# EAGLE schematic testtool (EAGLE 9.5.2)

## Sheet 1 of 7
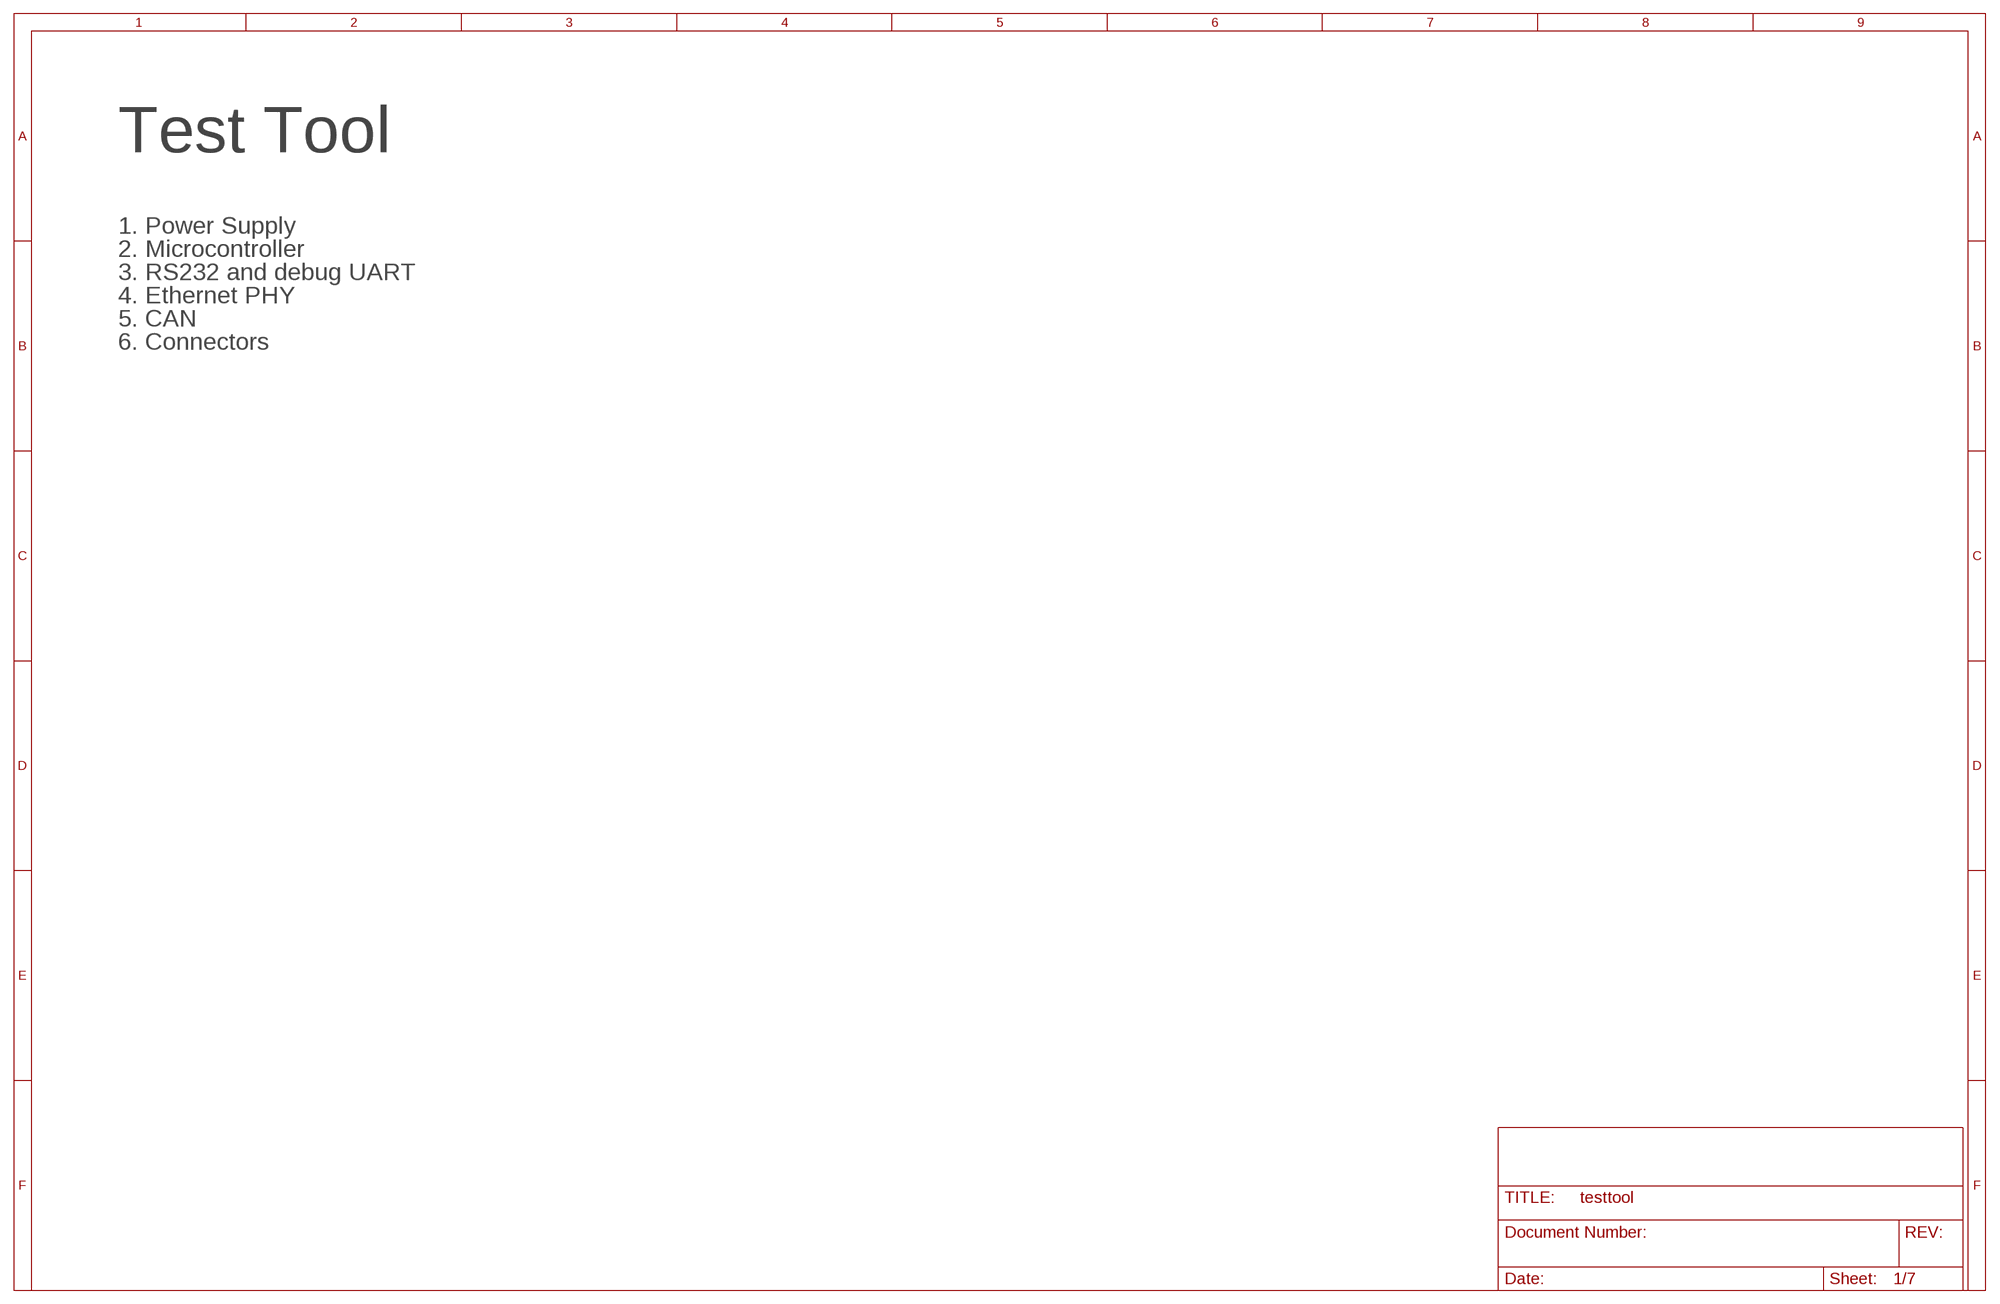
[diagram p0: schematic, sheet 1]

### Notes on the sheet
- Test Tool
- 1. Power Supply
- 2. Microcontroller
- 3. RS232 and debug UART
- 4. Ethernet PHY
- 5. CAN
- 6. Connectors

## Sheet 2 of 7
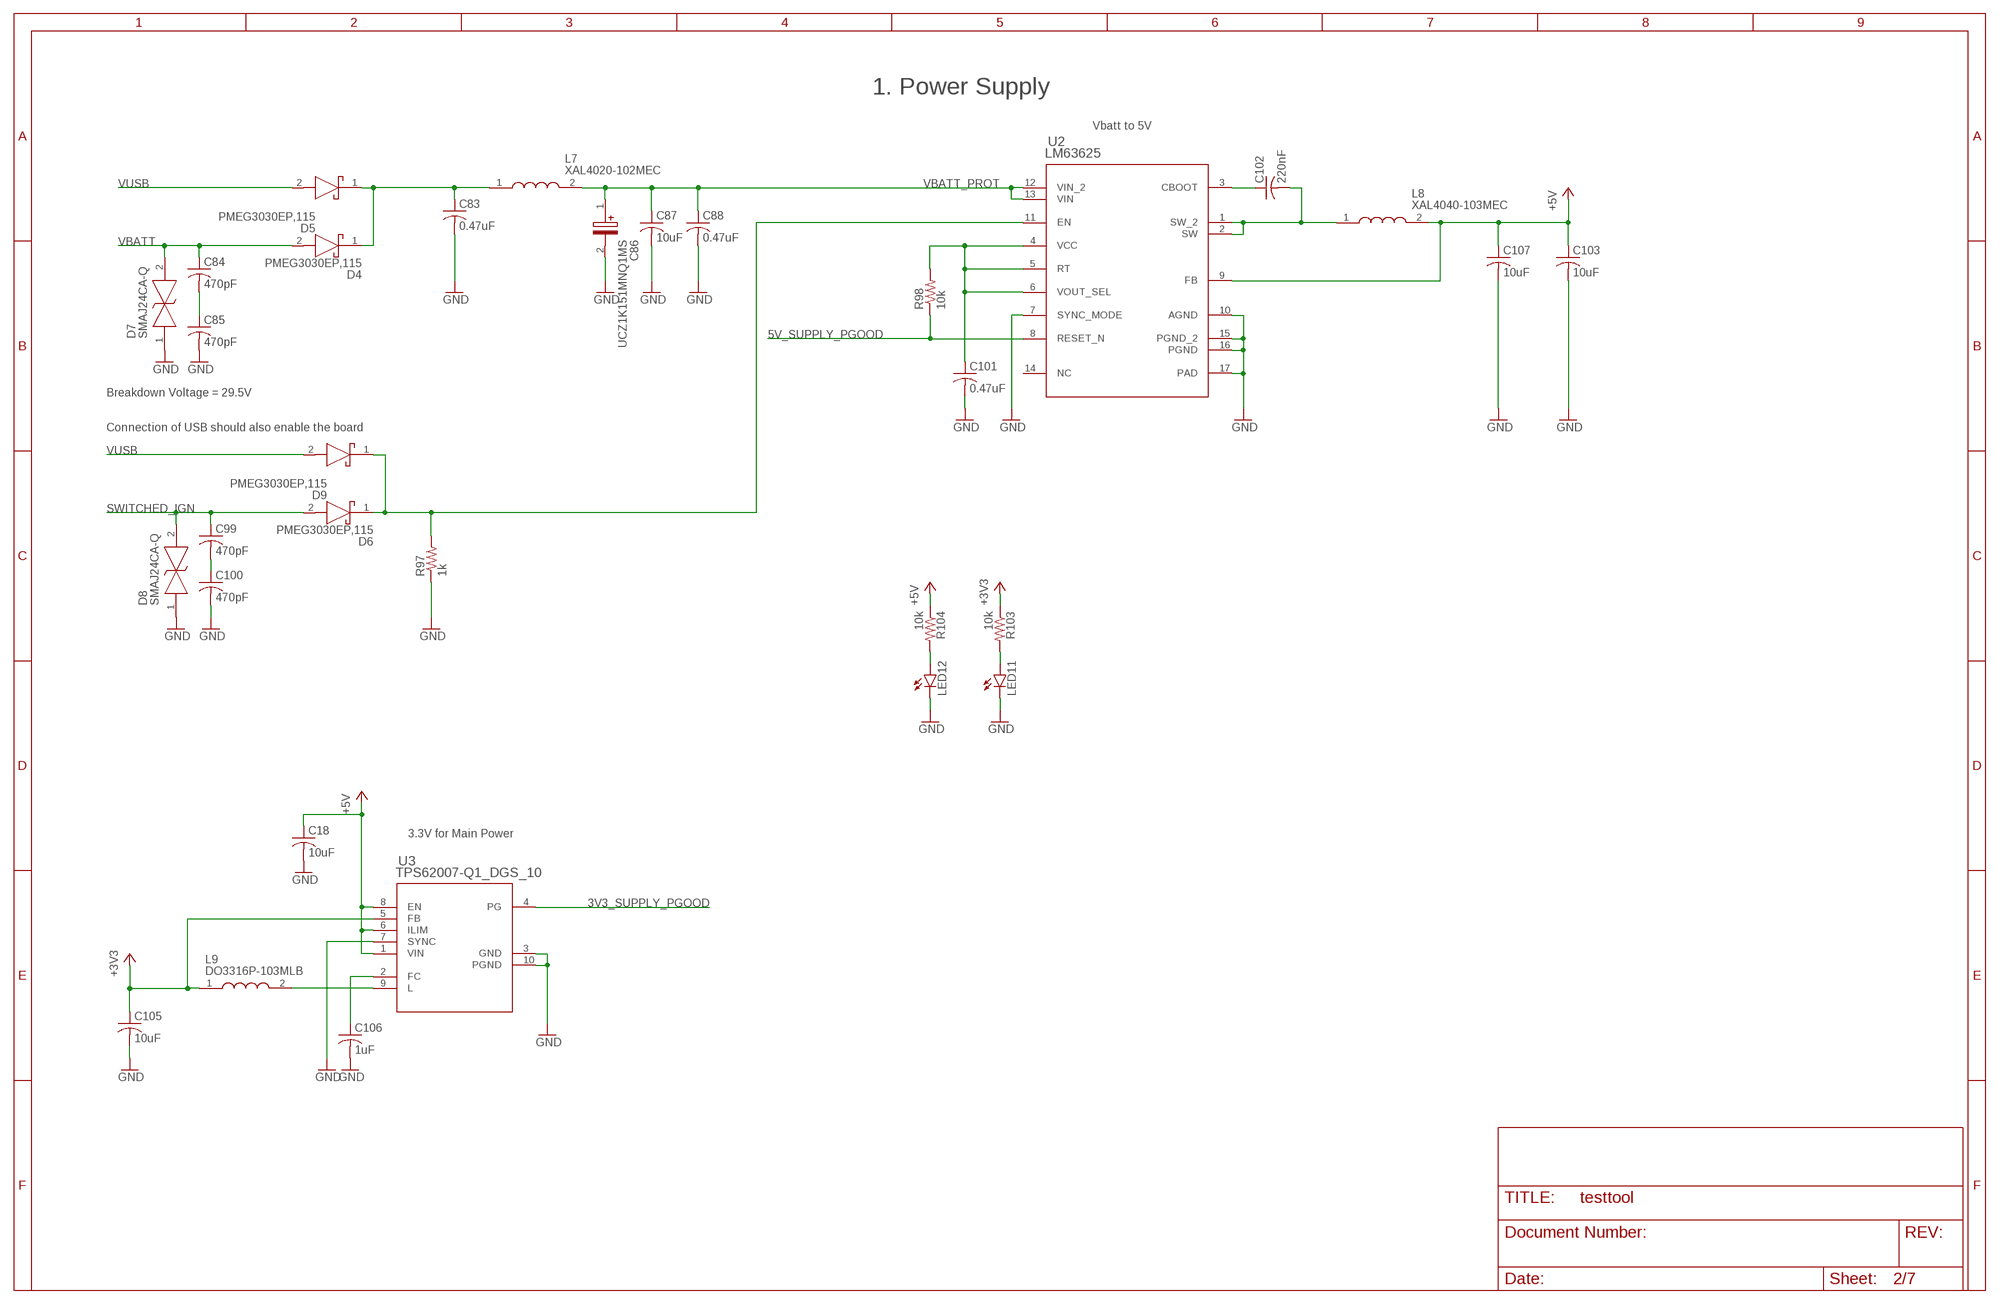
[diagram p1: schematic, sheet 2]

### Parts
C18  10uF  C-USC0805  [C0805]
C83  0.47uF  C-USC0805  [C0805]
C84  470pF  C-USC0805  [C0805]
C85  470pF  C-USC0805  [C0805]
C86  UCZ1K151MNQ1MS  [CAPAE1360X1450N]
C87  10uF  C-USC0805  [C0805]
C88  0.47uF  C-USC0805  [C0805]
C99  470pF  C-USC0805  [C0805]
C100  470pF  C-USC0805  [C0805]
C101  0.47uF  C-USC0603  [C0603]
C102  220nF  C-USC0805  [C0805]
C103  10uF  C-USC0805  [C0805]
C105  10uF  C-USC0805  [C0805]
C106  1uF  C-USC0603  [C0603]
C107  10uF  C-USC0805  [C0805]
D4  PMEG3030EP,115  [SODFL4725X110N]
D5  PMEG3030EP,115  [SODFL4725X110N]
D6  PMEG3030EP,115  [SODFL4725X110N]
D7  SMAJ24CA-Q  [DIONM5127X229N]
D8  SMAJ24CA-Q  [DIONM5127X229N]
D9  PMEG3030EP,115  [SODFL4725X110N]
L7  XAL4020-102MEC  [XAL40XX]
L8  XAL4040-103MEC  [XAL40XX]
L9  DO3316P-103MLB  [DO3316P103MLB]
LED11  LEDCHIPLED_0603  [CHIPLED_0603]
LED12  LEDCHIPLED_0603  [CHIPLED_0603]
R97  1k  R-US_R0805  [R0805]
R98  10k  R-US_R0603  [R0603]
R103  10k  R-US_R0603  [R0603]
R104  10k  R-US_R0603  [R0603]
U2  LM63625  LM63625DQPWPRQ1PWP0016K_L  [PWP0016K_L]
U3  TPS62007-Q1_DGS_10  [DGS10]

### Nets
3V3_SUPPLY_PGOOD: U3.4(PG) ; also sheet 3
5V_SUPPLY_PGOOD: R98.1 U2.8(RESET_N)
+3V3: C105.1 L9.1 R103.1 U3.5(FB) ; also sheet 3,4,5,6,7
+5V: C18.1 C103.1 C107.1 L8.2 R104.1 U2.9(FB) U3.1(VIN) U3.6(ILIM) U3.8(EN) ; also sheet 6,7
GND: C18.2 C83.2 C85.2 C86.2(-) C87.2 C88.2 C100.2 C101.2 C103.2 C105.2 C106.2 C107.2 D7.1 D8.1 LED11.C LED12.C R97.1 U2.7(SYNC_MODE) U2.10(AGND) U2.15(PGND_2) U2.16(PGND) U2.17(PAD) U3.3(GND) U3.7(SYNC) U3.10(PGND) ; also sheet 3,4,5,6,7
N$2: C99.2 C100.1
N$43: D6.1(K) D9.1(K) R97.2 U2.11(EN)
N$80: C83.1 D4.1(K) D5.1(K) L7.1
N$81: C84.2 C85.1
N$83: C101.1 R98.2 U2.4(VCC) U2.5(RT) U2.6(VOUT_SEL)
N$84: L9.2 U3.9(L)
N$85: C102.2 L8.1 U2.1(SW_2) U2.2(SW)
N$86: C106.1 U3.2(FC)
N$87: C102.1 U2.3(CBOOT)
N$91: LED11.A R103.2
N$93: LED12.A R104.2
SWITCHED_IGN: C99.1 D6.2(A) D8.2 ; also sheet 7
VBATT: C84.1 D4.2(A) D7.2 ; also sheet 7
VBATT_PROT: C86.1(+) C87.1 C88.1 L7.2 U2.12(VIN_2) U2.13(VIN)
VUSB: D5.2(A) D9.2(A) ; also sheet 7
Unconnected: U2.14(NC)

### Notes on the sheet
- 1. Power Supply
- Vbatt to 5V
- Breakdown Voltage = 29.5V
- Connection of USB should also enable the board
- 3.3V for Main Power

## Sheet 3 of 7
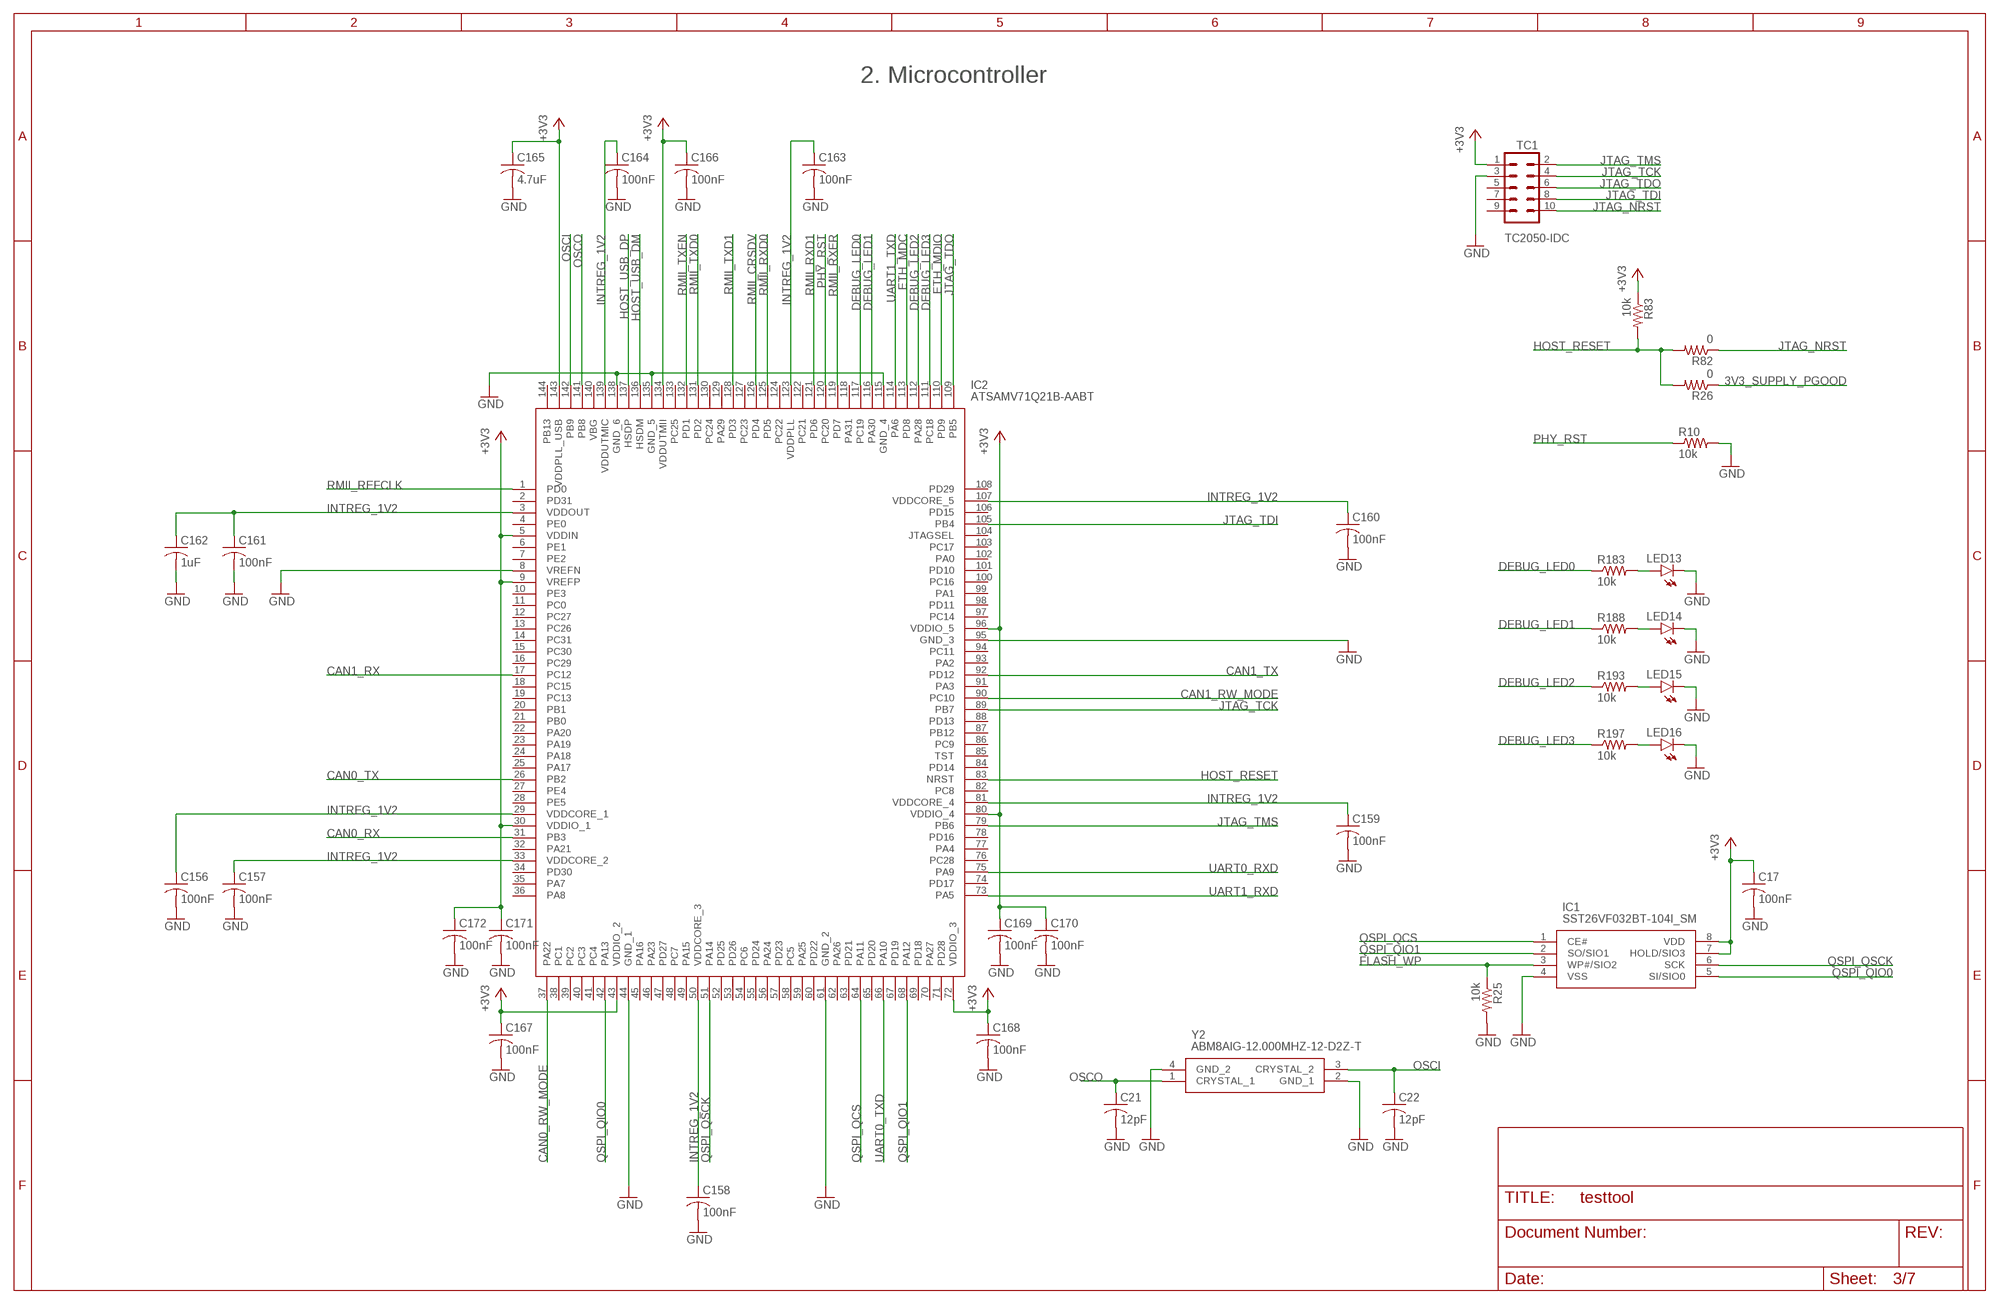
[diagram p2: schematic, sheet 3]

### Parts
C17  100nF  C-USC0603  [C0603]
C21  12pF  C-USC0603  [C0603]
C22  12pF  C-USC0603  [C0603]
C156  100nF  C-USC0603  [C0603]
C157  100nF  C-USC0603  [C0603]
C158  100nF  C-USC0603  [C0603]
C159  100nF  C-USC0603  [C0603]
C160  100nF  C-USC0603  [C0603]
C161  100nF  C-USC0603  [C0603]
C162  1uF  C-USC0603  [C0603]
C163  100nF  C-USC0603  [C0603]
C164  100nF  C-USC0603  [C0603]
C165  4.7uF  C-USC0603  [C0603]
C166  100nF  C-USC0603  [C0603]
C167  100nF  C-USC0603  [C0603]
C168  100nF  C-USC0603  [C0603]
C169  100nF  C-USC0603  [C0603]
C170  100nF  C-USC0603  [C0603]
C171  100nF  C-USC0603  [C0603]
C172  100nF  C-USC0603  [C0603]
IC1  SST26VF032BT-104I_SM  [SOIC127P794X203-8N]
IC2  ATSAMV71Q21B-AABT  [QFP50P2200X2200X160-144N]
LED13  LEDCHIPLED_0603  [CHIPLED_0603]
LED14  LEDCHIPLED_0603  [CHIPLED_0603]
LED15  LEDCHIPLED_0603  [CHIPLED_0603]
LED16  LEDCHIPLED_0603  [CHIPLED_0603]
R10  10k  R-US_R0603  [R0603]
R25  10k  R-US_R0603  [R0603]
R26  0  R-US_R0603  [R0603]
R82  0  R-US_R0603  [R0603]
R83  10k  R-US_R0603  [R0603]
R183  10k  R-US_R0603  [R0603]
R188  10k  R-US_R0603  [R0603]
R193  10k  R-US_R0603  [R0603]
R197  10k  R-US_R0603  [R0603]
TC1  TC2050-IDC  [TC2050-IDC]
Y2  ABM8AIG-12.000MHZ-12-D2Z-T  [ABM8AIG12000MHZ12D2ZT]

### Nets
3V3_SUPPLY_PGOOD: R26.1 ; also sheet 2
+3V3: C17.1 C165.1 C166.1 C167.1 C168.1 C169.1 C170.1 C171.1 C172.1 IC1.7(HOLD/SIO3) IC1.8(VDD) IC2.5(VDDIN) IC2.9(VREFP) IC2.30(VDDIO_1) IC2.43(VDDIO_2) IC2.72(VDDIO_3) IC2.80(VDDIO_4) IC2.96(VDDIO_5) IC2.134(VDDUTMII) IC2.143(VDDPLL_USB) R83.1 TC1.1 ; also sheet 2,4,5,6,7
CAN0_RW_MODE: IC2.37(PA22) ; also sheet 6
CAN0_RX: IC2.31(PB3) ; also sheet 6
CAN0_TX: IC2.26(PB2) ; also sheet 6
CAN1_RW_MODE: IC2.90(PC10) ; also sheet 6
CAN1_RX: IC2.17(PC12) ; also sheet 6
CAN1_TX: IC2.92(PD12) ; also sheet 6
DEBUG_LED0: IC2.117(PC19) R183.1
DEBUG_LED1: IC2.116(PA30) R188.1
DEBUG_LED2: IC2.112(PA28) R193.1
DEBUG_LED3: IC2.111(PC18) R197.1
ETH_MDC: IC2.113(PD8) ; also sheet 5
ETH_MDIO: IC2.110(PD9) ; also sheet 5
FLASH_WP: IC1.3(WP#/SIO2) R25.1
GND: C17.2 C21.2 C22.2 C156.2 C157.2 C158.2 C159.2 C160.2 C161.2 C162.2 C163.2 C164.2 C165.2 C166.2 C167.2 C168.2 C169.2 C170.2 C171.2 C172.2 IC1.4(VSS) IC2.8(VREFN) IC2.44(GND_1) IC2.61(GND_2) IC2.95(GND_3) IC2.115(GND_4) IC2.135(GND_5) IC2.138(GND_6) LED13.C LED14.C LED15.C LED16.C R10.2 R25.2 TC1.3 Y2.2(GND_1) Y2.4(GND_2) ; also sheet 2,4,5,6,7
HOST_RESET: IC2.83(NRST) R26.2 R82.2 R83.2
HOST_USB_DM: IC2.136(HSDM) ; also sheet 7
HOST_USB_DP: IC2.137(HSDP) ; also sheet 7
INTREG_1V2: C156.1 C157.1 C158.1 C159.1 C160.1 C161.1 C162.1 C163.1 C164.1 IC2.3(VDDOUT) IC2.29(VDDCORE_1) IC2.33(VDDCORE_2) IC2.50(VDDCORE_3) IC2.81(VDDCORE_4) IC2.107(VDDCORE_5) IC2.123(VDDPLL) IC2.139(VDDUTMIC)
JTAG_NRST: R82.1 TC1.10
JTAG_TCK: IC2.89(PB7) TC1.4
JTAG_TDI: IC2.105(PB4) TC1.8
JTAG_TDO: IC2.109(PB5) TC1.6
JTAG_TMS: IC2.79(PB6) TC1.2
N$22: LED13.A R183.2
N$23: LED14.A R188.2
N$156: LED15.A R193.2
N$157: LED16.A R197.2
OSCI: C22.1 IC2.142(PB9) Y2.3(CRYSTAL_2)
OSCO: C21.1 IC2.141(PB8) Y2.1(CRYSTAL_1)
PHY_RST: IC2.120(PC20) R10.1 ; also sheet 5
QSPI_QCS: IC1.1(CE#) IC2.64(PA11)
QSPI_QIO0: IC1.5(SI/SIO0) IC2.42(PA13)
QSPI_QIO1: IC1.2(SO/SIO1) IC2.68(PA12)
QSPI_QSCK: IC1.6(SCK) IC2.51(PA14)
RMII_CRSDV: IC2.126(PD4) ; also sheet 5
RMII_REFCLK: IC2.1(PD0) ; also sheet 5
RMII_RXD0: IC2.125(PD5) ; also sheet 5
RMII_RXD1: IC2.121(PD6) ; also sheet 5
RMII_RXER: IC2.119(PD7) ; also sheet 5
RMII_TXD0: IC2.131(PD2) ; also sheet 5
RMII_TXD1: IC2.128(PD3) ; also sheet 5
RMII_TXEN: IC2.132(PD1) ; also sheet 5
UART0_RXD: IC2.75(PA9) ; also sheet 4
UART0_TXD: IC2.66(PA10) ; also sheet 4
UART1_RXD: IC2.73(PA5) ; also sheet 4
UART1_TXD: IC2.114(PA6) ; also sheet 4
Unconnected: IC2.2(PD31) IC2.4(PE0) IC2.6(PE1) IC2.7(PE2) IC2.10(PE3) IC2.11(PC0) IC2.12(PC27) IC2.13(PC26) IC2.14(PC31) IC2.15(PC30) IC2.16(PC29) IC2.18(PC15) IC2.19(PC13) IC2.20(PB1) IC2.21(PB0) IC2.22(PA20) IC2.23(PA19) IC2.24(PA18) IC2.25(PA17) IC2.27(PE4) IC2.28(PE5) IC2.32(PA21) IC2.34(PD30) IC2.35(PA7) IC2.36(PA8) IC2.38(PC1) IC2.39(PC2) IC2.40(PC3) IC2.41(PC4) IC2.45(PA16) IC2.46(PA23) IC2.47(PD27) IC2.48(PC7) IC2.49(PA15) IC2.52(PD25) IC2.53(PD26) IC2.54(PC6) IC2.55(PD24) IC2.56(PA24) IC2.57(PD23) IC2.58(PC5) IC2.59(PA25) IC2.60(PD22) IC2.62(PA26) IC2.63(PD21) IC2.65(PD20) IC2.67(PD19) IC2.69(PD18) IC2.70(PA27) IC2.71(PD28) IC2.74(PD17) IC2.76(PC28) IC2.77(PA4) IC2.78(PD16) IC2.82(PC8) IC2.84(PD14) IC2.85(TST) IC2.86(PC9) IC2.87(PB12) IC2.88(PD13) IC2.91(PA3) IC2.93(PA2) IC2.94(PC11) IC2.97(PC14) IC2.98(PD11) IC2.99(PA1) IC2.100(PC16) IC2.101(PD10) IC2.102(PA0) IC2.103(PC17) IC2.104(JTAGSEL) IC2.106(PD15) IC2.108(PD29) IC2.118(PA31) IC2.122(PC21) IC2.124(PC22) IC2.127(PC23) IC2.129(PA29) IC2.130(PC24) IC2.133(PC25) IC2.140(VBG) IC2.144(PB13) TC1.5 TC1.7 TC1.9

### Notes on the sheet
- 2. Microcontroller

## Sheet 4 of 7
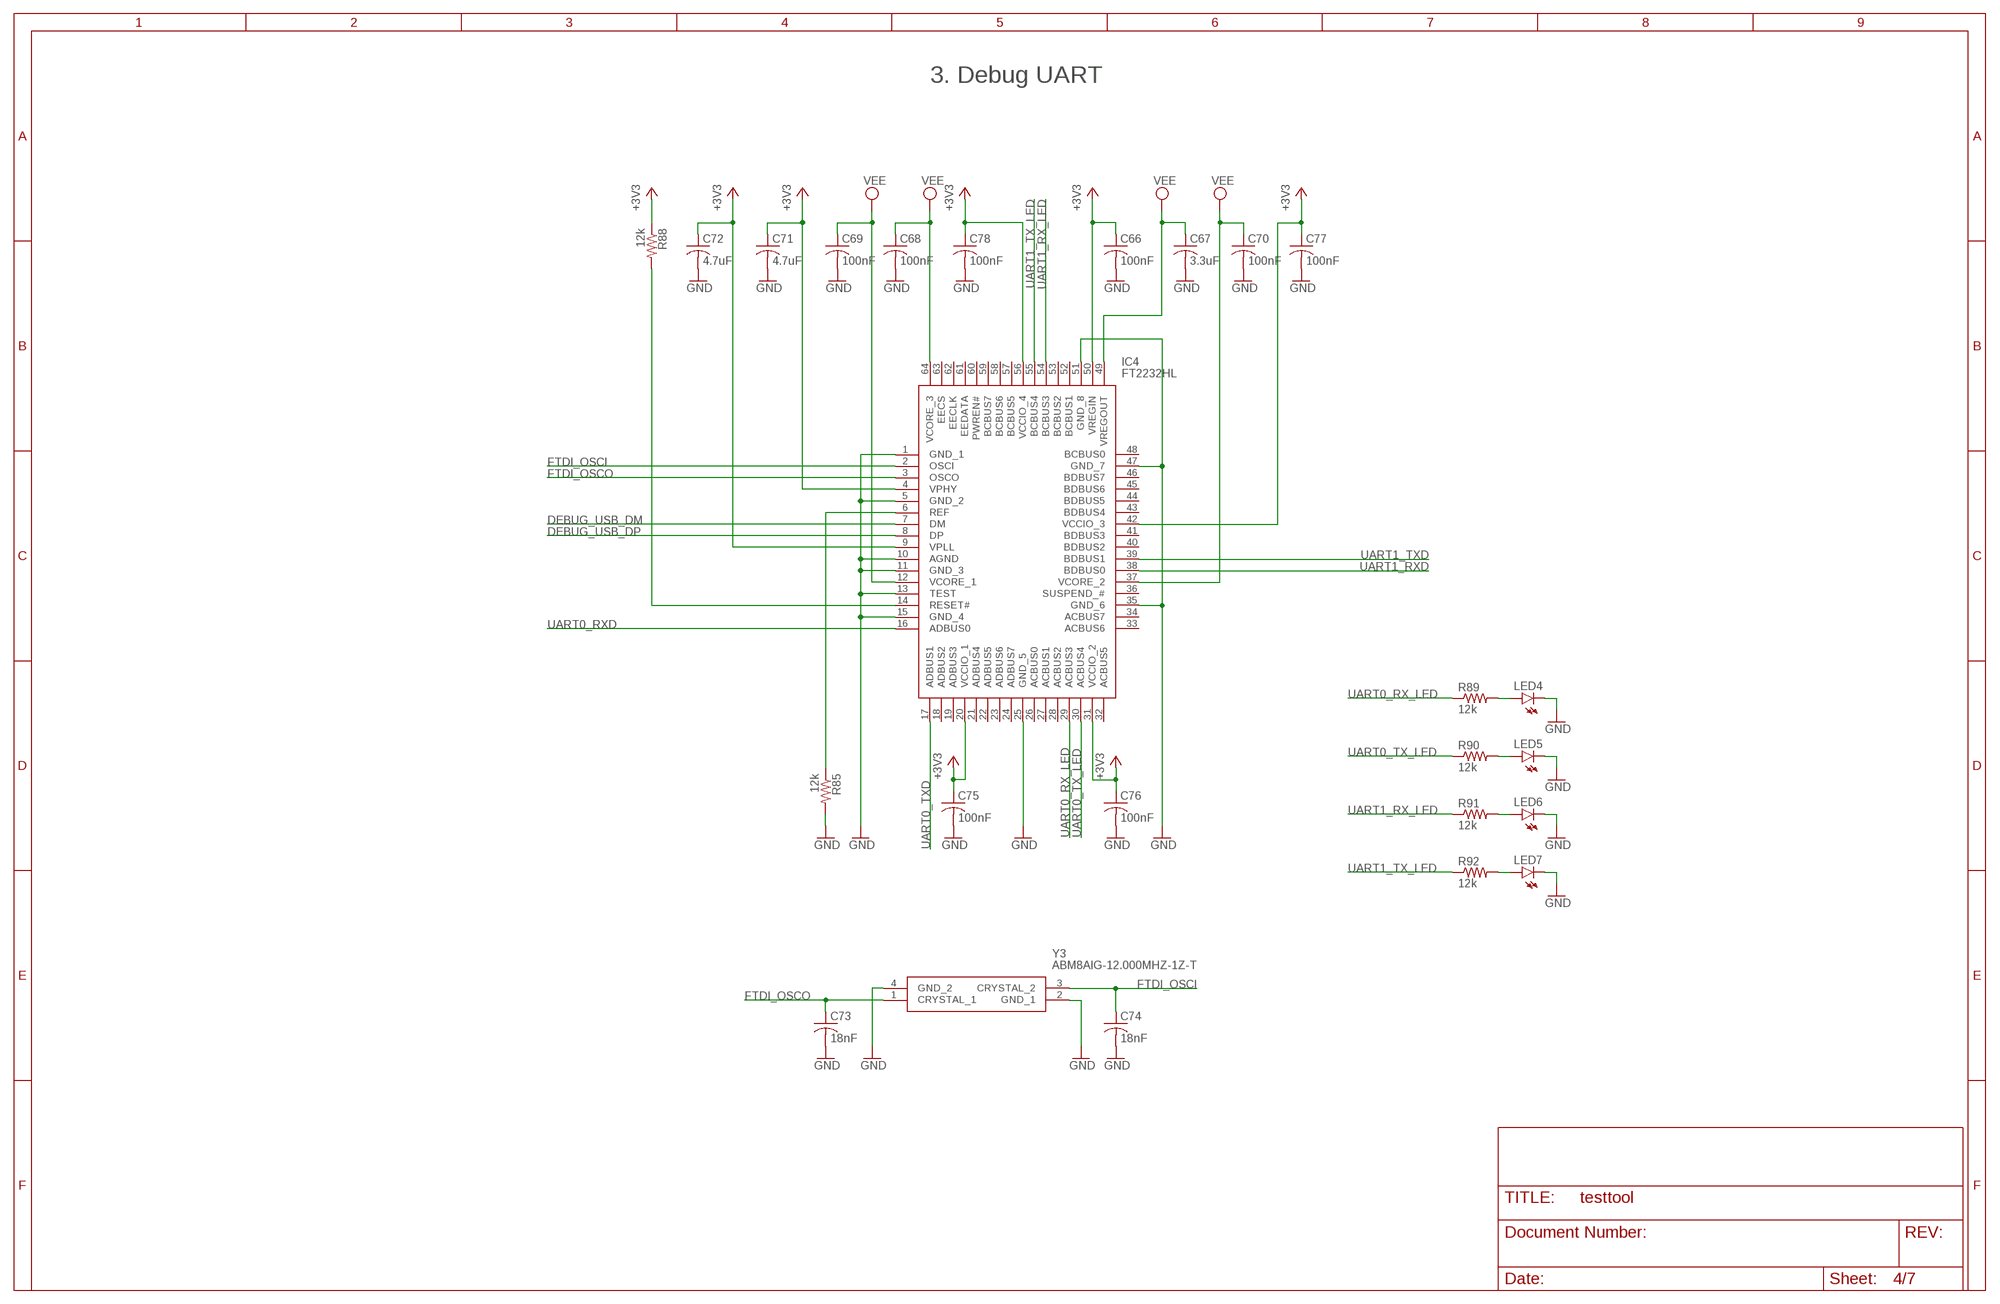
[diagram p3: schematic, sheet 4]

### Parts
C66  100nF  C-USC0603  [C0603]
C67  3.3uF  C-USC0603  [C0603]
C68  100nF  C-USC0603  [C0603]
C69  100nF  C-USC0603  [C0603]
C70  100nF  C-USC0603  [C0603]
C71  4.7uF  C-USC0603  [C0603]
C72  4.7uF  C-USC0603  [C0603]
C73  18nF  C-USC0603  [C0603]
C74  18nF  C-USC0603  [C0603]
C75  100nF  C-USC0603  [C0603]
C76  100nF  C-USC0603  [C0603]
C77  100nF  C-USC0603  [C0603]
C78  100nF  C-USC0603  [C0603]
IC4  FT2232HL  [QFP50P1200X1200X160-64N]
LED4  LEDCHIPLED_0603  [CHIPLED_0603]
LED5  LEDCHIPLED_0603  [CHIPLED_0603]
LED6  LEDCHIPLED_0603  [CHIPLED_0603]
LED7  LEDCHIPLED_0603  [CHIPLED_0603]
R85  12k  R-US_R0603  [R0603]
R88  12k  R-US_R0603  [R0603]
R89  12k  R-US_R0603  [R0603]
R90  12k  R-US_R0603  [R0603]
R91  12k  R-US_R0603  [R0603]
R92  12k  R-US_R0603  [R0603]
Y3  ABM8AIG-12.000MHZ-1Z-T  [ABM8AIG25000MHZ122ZT3]

### Nets
+3V3: C66.1 C71.1 C72.1 C75.1 C76.1 C77.1 C78.1 IC4.4(VPHY) IC4.9(VPLL) IC4.20(VCCIO_1) IC4.31(VCCIO_2) IC4.42(VCCIO_3) IC4.50(VREGIN) IC4.56(VCCIO_4) R88.1 ; also sheet 2,3,5,6,7
DEBUG_USB_DM: IC4.7(DM) ; also sheet 7
DEBUG_USB_DP: IC4.8(DP) ; also sheet 7
FTDI_OSCI: C74.1 IC4.2(OSCI) Y3.3(CRYSTAL_2)
FTDI_OSCO: C73.1 IC4.3(OSCO) Y3.1(CRYSTAL_1)
GND: C66.2 C67.2 C68.2 C69.2 C70.2 C71.2 C72.2 C73.2 C74.2 C75.2 C76.2 C77.2 C78.2 IC4.1(GND_1) IC4.5(GND_2) IC4.10(AGND) IC4.11(GND_3) IC4.13(TEST) IC4.15(GND_4) IC4.25(GND_5) IC4.35(GND_6) IC4.47(GND_7) IC4.51(GND_8) LED4.C LED5.C LED6.C LED7.C R85.2 Y3.2(GND_1) Y3.4(GND_2) ; also sheet 2,3,5,6,7
N$69: IC4.6(REF) R85.1
N$70: IC4.14(RESET#) R88.2
N$71: LED5.A R90.2
N$72: LED4.A R89.2
N$73: LED6.A R91.2
N$74: LED7.A R92.2
UART0_RX_LED: IC4.29(ACBUS3) R89.1
UART0_RXD: IC4.16(ADBUS0) ; also sheet 3
UART0_TX_LED: IC4.30(ACBUS4) R90.1
UART0_TXD: IC4.17(ADBUS1) ; also sheet 3
UART1_RX_LED: IC4.54(BCBUS3) R91.1
UART1_RXD: IC4.38(BDBUS0) ; also sheet 3
UART1_TX_LED: IC4.55(BCBUS4) R92.1
UART1_TXD: IC4.39(BDBUS1) ; also sheet 3
VEE: C67.1 C68.1 C69.1 C70.1 IC4.12(VCORE_1) IC4.37(VCORE_2) IC4.49(VREGOUT) IC4.64(VCORE_3)
Unconnected: IC4.18(ADBUS2) IC4.19(ADBUS3) IC4.21(ADBUS4) IC4.22(ADBUS5) IC4.23(ADBUS6) IC4.24(ADBUS7) IC4.26(ACBUS0) IC4.27(ACBUS1) IC4.28(ACBUS2) IC4.32(ACBUS5) IC4.33(ACBUS6) IC4.34(ACBUS7) IC4.36(SUSPEND_#) IC4.40(BDBUS2) IC4.41(BDBUS3) IC4.43(BDBUS4) IC4.44(BDBUS5) IC4.45(BDBUS6) IC4.46(BDBUS7) IC4.48(BCBUS0) IC4.52(BCBUS1) IC4.53(BCBUS2) IC4.57(BCBUS5) IC4.58(BCBUS6) IC4.59(BCBUS7) IC4.60(PWREN#) IC4.61(EEDATA) IC4.62(EECLK) IC4.63(EECS)

### Notes on the sheet
- 3. Debug UART

## Sheet 5 of 7
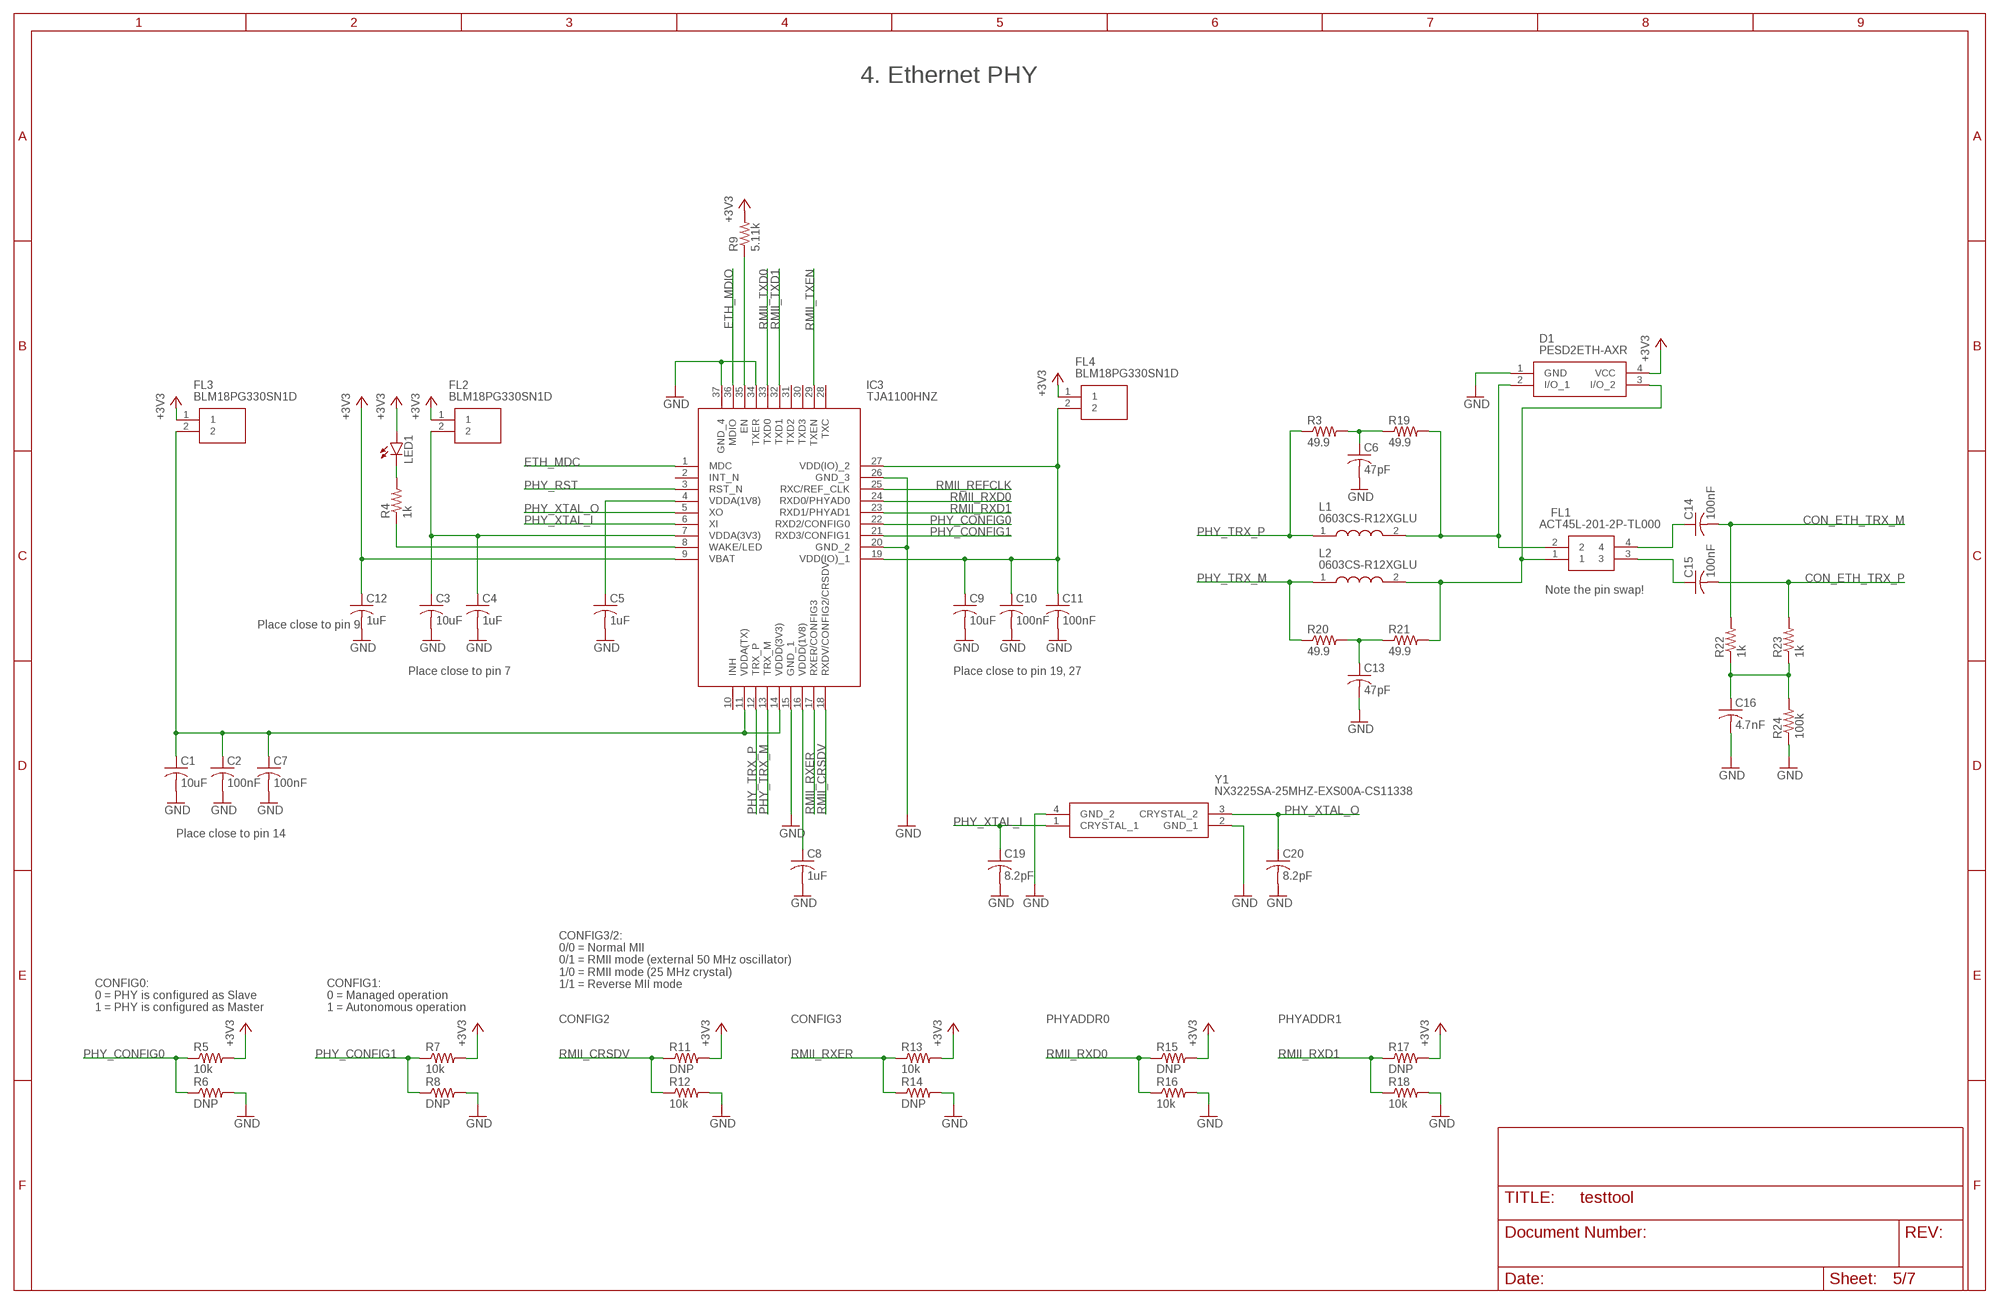
[diagram p4: schematic, sheet 5]

### Parts
C1  10uF  C-USC0603  [C0603]
C2  100nF  C-USC0603  [C0603]
C3  10uF  C-USC0603  [C0603]
C4  1uF  C-USC0603  [C0603]
C5  1uF  C-USC0603  [C0603]
C6  47pF  C-USC0603  [C0603]
C7  100nF  C-USC0603  [C0603]
C8  1uF  C-USC0603  [C0603]
C9  10uF  C-USC0603  [C0603]
C10  100nF  C-USC0603  [C0603]
C11  100nF  C-USC0603  [C0603]
C12  1uF  C-USC0603  [C0603]
C13  47pF  C-USC0603  [C0603]
C14  100nF  C-USC0603  [C0603]
C15  100nF  C-USC0603  [C0603]
C16  4.7nF  C-USC0603  [C0603]
C19  8.2pF  C-USC0603  [C0603]
C20  8.2pF  C-USC0603  [C0603]
D1  PESD2ETH-AXR  [PESD2ETHAXR]
FL1  ACT45L-201-2P-TL000  [ACT45L_1]
FL2  BLM18PG330SN1D  [BEADC1608X95N]
FL3  BLM18PG330SN1D  [BEADC1608X95N]
FL4  BLM18PG330SN1D  [BEADC1608X95N]
IC3  TJA1100HNZ  [QFN50P600X600X100-37N]
L1  0603CS-R12XGLU  [0603CS82NXGLW]
L2  0603CS-R12XGLU  [0603CS82NXGLW]
LED1  LEDCHIPLED_0603  [CHIPLED_0603]
R3  49.9  R-US_R0603  [R0603]
R4  1k  R-US_R0603  [R0603]
R5  10k  R-US_R0603  [R0603]
R6  DNP  R-US_R0603  [R0603]
R7  10k  R-US_R0603  [R0603]
R8  DNP  R-US_R0603  [R0603]
R9  5.11k  R-US_R0603  [R0603]
R11  DNP  R-US_R0603  [R0603]
R12  10k  R-US_R0603  [R0603]
R13  10k  R-US_R0603  [R0603]
R14  DNP  R-US_R0603  [R0603]
R15  DNP  R-US_R0603  [R0603]
R16  10k  R-US_R0603  [R0603]
R17  DNP  R-US_R0603  [R0603]
R18  10k  R-US_R0603  [R0603]
R19  49.9  R-US_R0603  [R0603]
R20  49.9  R-US_R0603  [R0603]
R21  49.9  R-US_R0603  [R0603]
R22  1k  R-US_R0603  [R0603]
R23  1k  R-US_R0603  [R0603]
R24  100k  R-US_R0603  [R0603]
Y1  NX3225SA-25MHZ-EXS00A-CS11338  [NX3225SA25MHZEXS00ACS11338]

### Nets
+3V3: C12.1 D1.4(VCC) FL2.1 FL3.1 FL4.1 IC3.9(VBAT) LED1.A R5.2 R7.2 R9.2 R11.2 R13.2 R15.2 R17.2 ; also sheet 2,3,4,6,7
CON_ETH_TRX_M: C14.2 R22.2 ; also sheet 7
CON_ETH_TRX_P: C15.2 R23.2 ; also sheet 7
ETH_MDC: IC3.1(MDC) ; also sheet 3
ETH_MDIO: IC3.36(MDIO) ; also sheet 3
GND: C1.2 C2.2 C3.2 C4.2 C5.2 C6.2 C7.2 C8.2 C9.2 C10.2 C11.2 C12.2 C13.2 C16.2 C19.2 C20.2 D1.1(GND) IC3.15(GND_1) IC3.20(GND_2) IC3.26(GND_3) IC3.34(TXER) IC3.37(GND_4) R6.2 R8.2 R12.2 R14.2 R16.2 R18.2 R24.1 Y1.2(GND_1) Y1.4(GND_2) ; also sheet 2,3,4,6,7
N$4: LED1.C R4.2
N$5: C5.1 IC3.4(VDDA(1V8))
N$6: IC3.8(WAKE/LED) R4.1
N$7: C8.1 IC3.16(VDDD(1V8))
N$8: C3.1 C4.1 FL2.2 IC3.7(VDDA(3V3))
N$9: C1.1 C2.1 C7.1 FL3.2 IC3.11(VDDA(TX)) IC3.14(VDDD(3V3))
N$10: C9.1 C10.1 C11.1 FL4.2 IC3.19(VDD(IO)_1) IC3.27(VDD(IO)_2)
N$11: IC3.35(EN) R9.1
N$13: D1.3(I/O_2) FL1.1 L2.2 R21.2
N$14: D1.2(I/O_1) FL1.2 L1.2 R19.2
N$15: C6.1 R3.2 R19.1
N$16: C13.1 R20.2 R21.1
N$17: C14.1 FL1.4
N$18: C15.1 FL1.3
N$19: C16.1 R22.1 R23.1 R24.2
PHY_CONFIG0: IC3.22(RXD2/CONFIG0) R5.1 R6.1
PHY_CONFIG1: IC3.21(RXD3/CONFIG1) R7.1 R8.1
PHY_RST: IC3.3(RST_N) ; also sheet 3
PHY_TRX_M: IC3.13(TRX_M) L2.1 R20.1
PHY_TRX_P: IC3.12(TRX_P) L1.1 R3.1
PHY_XTAL_I: C19.1 IC3.6(XI) Y1.1(CRYSTAL_1)
PHY_XTAL_O: C20.1 IC3.5(XO) Y1.3(CRYSTAL_2)
RMII_CRSDV: IC3.18(RXDV/CONFIG2/CRSDV) R11.1 R12.1 ; also sheet 3
RMII_REFCLK: IC3.25(RXC/REF_CLK) ; also sheet 3
RMII_RXD0: IC3.24(RXD0/PHYAD0) R15.1 R16.1 ; also sheet 3
RMII_RXD1: IC3.23(RXD1/PHYAD1) R17.1 R18.1 ; also sheet 3
RMII_RXER: IC3.17(RXER/CONFIG3) R13.1 R14.1 ; also sheet 3
RMII_TXD0: IC3.33(TXD0) ; also sheet 3
RMII_TXD1: IC3.32(TXD1) ; also sheet 3
RMII_TXEN: IC3.29(TXEN) ; also sheet 3
Unconnected: IC3.2(INT_N) IC3.10(INH) IC3.28(TXC) IC3.30(TXD3) IC3.31(TXD2)

### Notes on the sheet
- 4. Ethernet PHY
- Note the pin swap!
- Place close to pin 9
- Place close to pin 7 | Place close to pin 19, 27
- Place close to pin 14
- CONFIG3/2:
  0/0 = Normal MII
  0/1 = RMII mode (external 50 MHz oscillator)
  1/0 = RMII mode (25 MHz crystal)
  1/1 = Reverse MII mode
- CONFIG0:
  0 = PHY is configured as Slave
  1 = PHY is configured as Master
- CONFIG1:
  0 = Managed operation
  1 = Autonomous operation
- CONFIG2 | CONFIG3 | PHYADDR0 | PHYADDR1

## Sheet 6 of 7
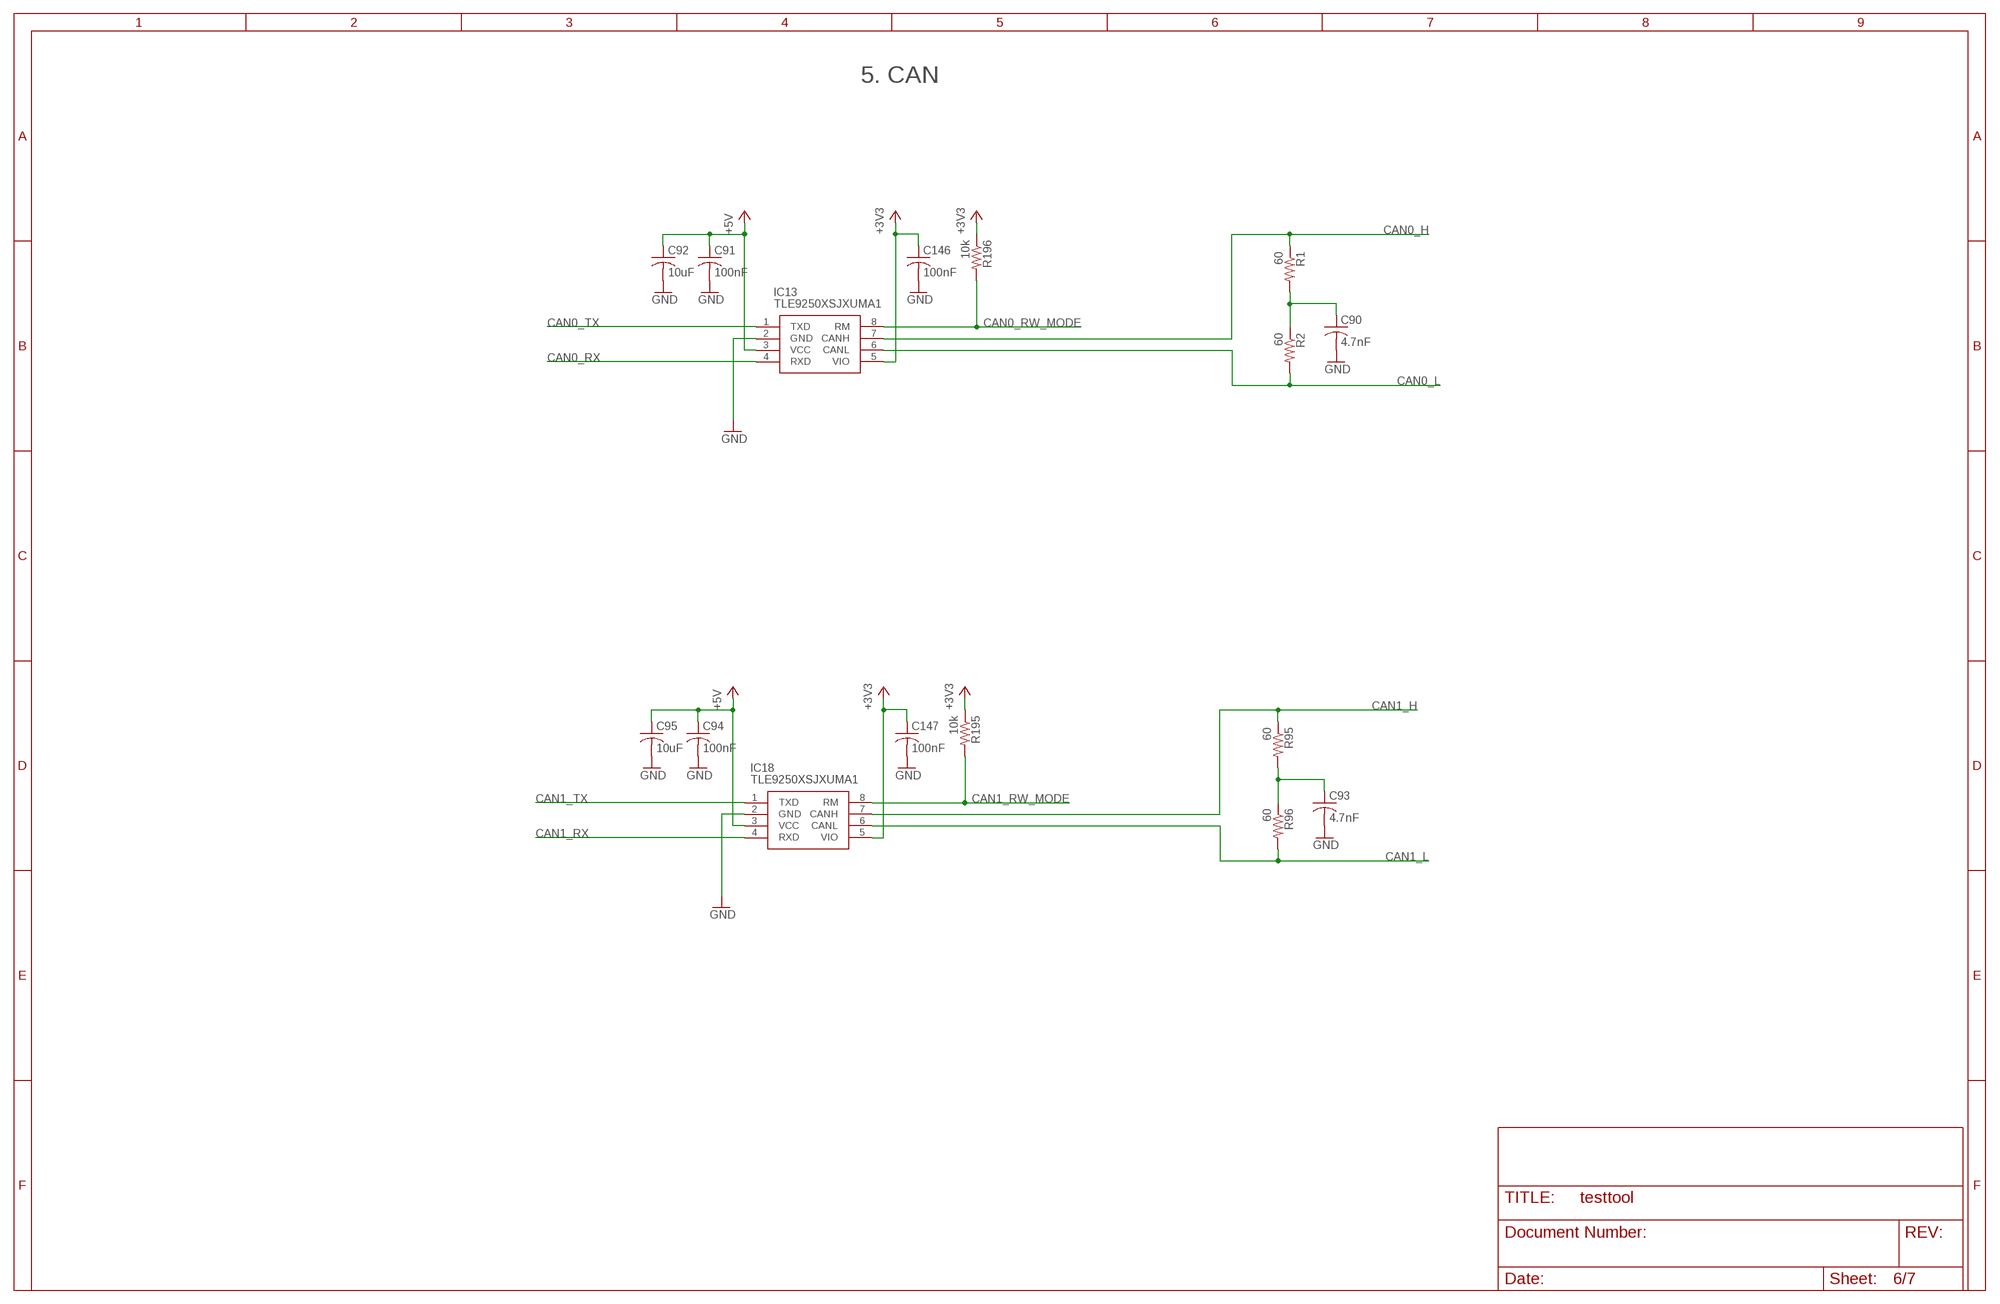
[diagram p5: schematic, sheet 6]

### Parts
C90  4.7nF  C-USC0603  [C0603]
C91  100nF  C-USC0603  [C0603]
C92  10uF  C-USC0603  [C0603]
C93  4.7nF  C-USC0603  [C0603]
C94  100nF  C-USC0603  [C0603]
C95  10uF  C-USC0603  [C0603]
C146  100nF  C-USC0603  [C0603]
C147  100nF  C-USC0603  [C0603]
IC13  TLE9250XSJXUMA1  [SOIC127P602X173-8N]
IC18  TLE9250XSJXUMA1  [SOIC127P602X173-8N]
R1  60  R-US_R0805  [R0805]
R2  60  R-US_R0805  [R0805]
R95  60  R-US_R0805  [R0805]
R96  60  R-US_R0805  [R0805]
R195  10k  R-US_R0603  [R0603]
R196  10k  R-US_R0603  [R0603]

### Nets
+3V3: C146.1 C147.1 IC13.5(VIO) IC18.5(VIO) R195.1 R196.1 ; also sheet 2,3,4,5,7
+5V: C91.1 C92.1 C94.1 C95.1 IC13.3(VCC) IC18.3(VCC) ; also sheet 2,7
CAN0_H: IC13.7(CANH) R1.1 ; also sheet 7
CAN0_L: IC13.6(CANL) R2.2 ; also sheet 7
CAN0_RW_MODE: IC13.8(RM) R196.2 ; also sheet 3
CAN0_RX: IC13.4(RXD) ; also sheet 3
CAN0_TX: IC13.1(TXD) ; also sheet 3
CAN1_H: IC18.7(CANH) R95.1 ; also sheet 7
CAN1_L: IC18.6(CANL) R96.2 ; also sheet 7
CAN1_RW_MODE: IC18.8(RM) R195.2 ; also sheet 3
CAN1_RX: IC18.4(RXD) ; also sheet 3
CAN1_TX: IC18.1(TXD) ; also sheet 3
GND: C90.2 C91.2 C92.2 C93.2 C94.2 C95.2 C146.2 C147.2 IC13.2(GND) IC18.2(GND) ; also sheet 2,3,4,5,7
N$3: C93.1 R95.2 R96.1
N$82: C90.1 R1.2 R2.1

### Notes on the sheet
- 5. CAN

## Sheet 7 of 7
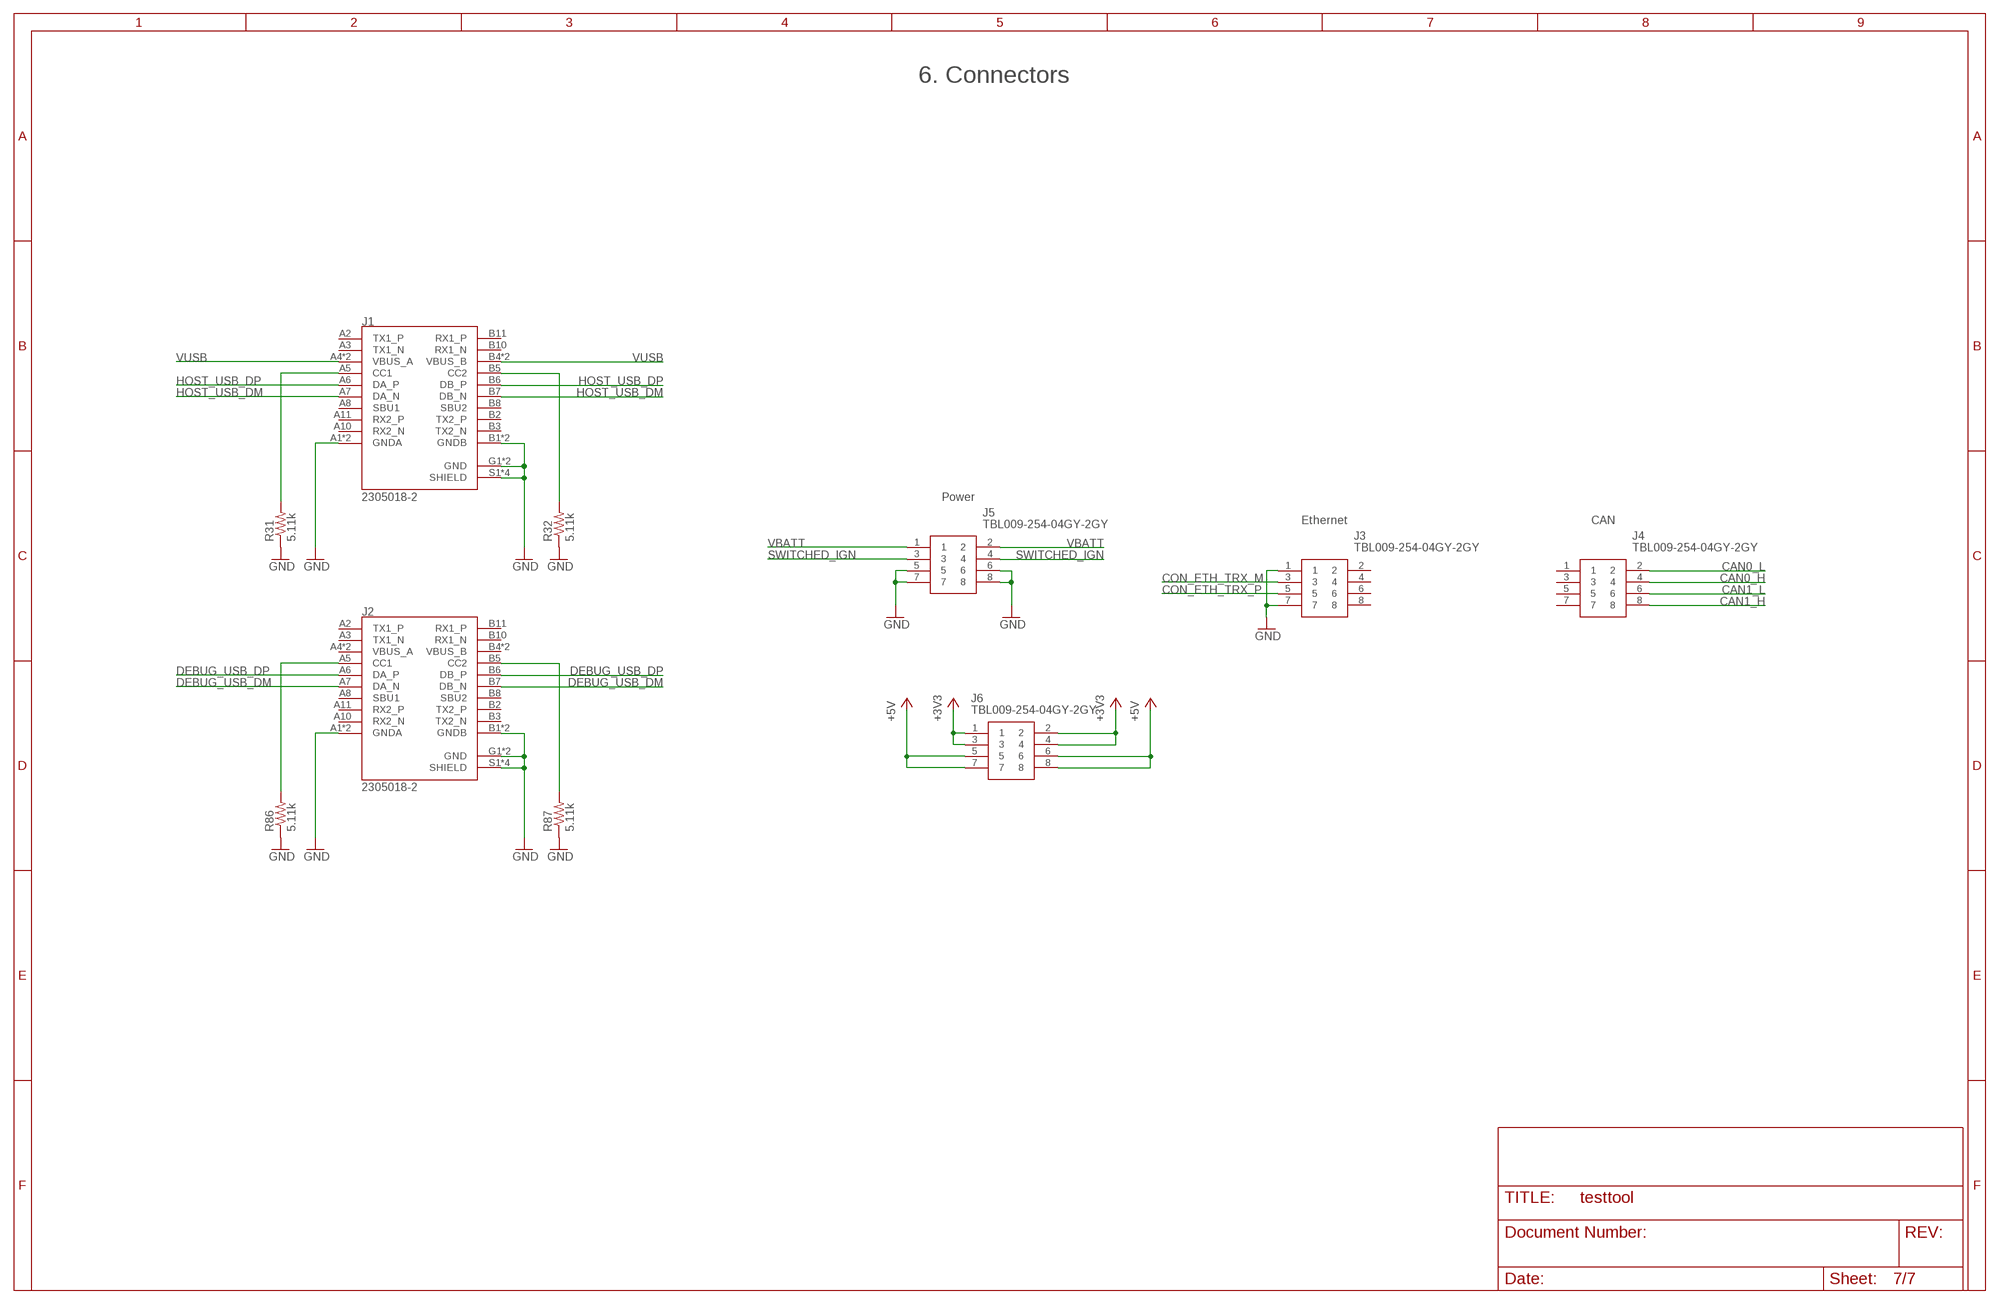
[diagram p6: schematic, sheet 7]

### Parts
J1  2305018-2  [TE_2305018-2]
J2  2305018-2  [TE_2305018-2]
J3  TBL009-254-04GY-2GY  [TBL00925404GY2GY]
J4  TBL009-254-04GY-2GY  [TBL00925404GY2GY]
J5  TBL009-254-04GY-2GY  [TBL00925404GY2GY]
J6  TBL009-254-04GY-2GY  [TBL00925404GY2GY]
R31  5.11k  R-US_R0603  [R0603]
R32  5.11k  R-US_R0603  [R0603]
R86  5.11k  R-US_R0603  [R0603]
R87  5.11k  R-US_R0603  [R0603]

### Nets
+3V3: J6.1 J6.2 J6.3 J6.4 ; also sheet 2,3,4,5,6
+5V: J6.5 J6.6 J6.7 J6.8 ; also sheet 2,6
CAN0_H: J4.4 ; also sheet 6
CAN0_L: J4.2 ; also sheet 6
CAN1_H: J4.8 ; also sheet 6
CAN1_L: J4.6 ; also sheet 6
CON_ETH_TRX_M: J3.3 ; also sheet 5
CON_ETH_TRX_P: J3.5 ; also sheet 5
DEBUG_USB_DM: J2.A7(DA_N) J2.B7(DB_N) ; also sheet 4
DEBUG_USB_DP: J2.A6(DA_P) J2.B6(DB_P) ; also sheet 4
GND: J1.A1(GNDA) J1.A12(GNDA) J1.B1(GNDB) J1.B12(GNDB) J1.G1(GND) J1.G2(GND) J1.S1(SHIELD) J1.S2(SHIELD) J1.S3(SHIELD) J1.S4(SHIELD) J2.A1(GNDA) J2.A12(GNDA) J2.B1(GNDB) J2.B12(GNDB) J2.G1(GND) J2.G2(GND) J2.S1(SHIELD) J2.S2(SHIELD) J2.S3(SHIELD) J2.S4(SHIELD) J3.1 J3.7 J5.5 J5.6 J5.7 J5.8 R31.1 R32.1 R86.1 R87.1 ; also sheet 2,3,4,5,6
HOST_USB_DM: J1.A7(DA_N) J1.B7(DB_N) ; also sheet 3
HOST_USB_DP: J1.A6(DA_P) J1.B6(DB_P) ; also sheet 3
N$1: J1.A5(CC1) R31.2
N$20: J1.B5(CC2) R32.2
N$67: J2.A5(CC1) R86.2
N$68: J2.B5(CC2) R87.2
SWITCHED_IGN: J5.3 J5.4 ; also sheet 2
VBATT: J5.1 J5.2 ; also sheet 2
VUSB: J1.A4(VBUS_A) J1.A9(VBUS_A) J1.B4(VBUS_B) J1.B9(VBUS_B) ; also sheet 2
Unconnected: J1.A2(TX1_P) J1.A3(TX1_N) J1.A8(SBU1) J1.A10(RX2_N) J1.A11(RX2_P) J1.B2(TX2_P) J1.B3(TX2_N) J1.B8(SBU2) J1.B10(RX1_N) J1.B11(RX1_P) J2.A2(TX1_P) J2.A3(TX1_N) J2.A4(VBUS_A) J2.A8(SBU1) J2.A9(VBUS_A) J2.A10(RX2_N) J2.A11(RX2_P) J2.B2(TX2_P) J2.B3(TX2_N) J2.B4(VBUS_B) J2.B8(SBU2) J2.B9(VBUS_B) J2.B10(RX1_N) J2.B11(RX1_P) J3.2 J3.4 J3.6 J3.8 J4.1 J4.3 J4.5 J4.7

### Notes on the sheet
- 6. Connectors
- Power
- Ethernet | CAN

## Library data of the parts
C1-C22 C66-C78 C83-C85 C87 C88 C90-C95 C99-C103 C105-C107 C146 C147 C156-C172 = rcl:C-US: CAPACITOR, American symbol; SPICEPREFIX: C
C86 = samacsys:UCZ1K151MNQ1MS: Aluminum Electrolytic Capacitors - SMD 80V 150UF 20% Source: Datasheet <http://www.nichicon.co.jp/english/products/pdfs/e-ucz.pdf>; DESCRIPTION: Aluminum Electrolytic Capacitors - SMD 80V 150UF 20%; HEIGHT: 14.5mm; MANUFACTURER_NAME: Nichicon; MANUFACTURER_PART_NUMBER: UCZ1K151MNQ1MS; MOUSER_PART_NUMBER: 647-UCZ1K151MNQ1MS; MOUSER_PRICE-STOCK: https://www.mouser.com/Search/Refine.aspx?Keyword=647-UCZ1K151MNQ1MS
D1 = samacsys:PESD2ETH-AXR: ESD Suppressors / TVS Diodes PESD2ETH-AX/SOT4/REEL 7" Q3/T4 Source: Datasheet <https://assets.nexperia.com/documents/data-sheet/PESD2ETH-AX.pdf>; DESCRIPTION: ESD Suppressors / TVS Diodes PESD2ETH-AX/SOT4/REEL 7" Q3/T4; HEIGHT: 1mm; MANUFACTURER_NAME: Nexperia; MANUFACTURER_PART_NUMBER: PESD2ETH-AXR; MOUSER_PART_NUMBER: 771-PESD2ETH-AXR; MOUSER_PRICE-STOCK: https://www.mouser.com/Search/Refine.aspx?Keyword=771-PESD2ETH-AXR
D4-D6 D9 = samacsys:PMEG3030EP,115: Nexperia PMEG3030EP,115 SMT Schottky Diode, 30V 3A, 2-Pin SOD128 Source: Datasheet <https://assets.nexperia.com/documents/data-sheet/PMEG3030EP.pdf>; DESCRIPTION: Nexperia PMEG3030EP,115 SMT Schottky Diode, 30V 3A, 2-Pin SOD128; HEIGHT: 1.1mm; MANUFACTURER_NAME: Nexperia; MANUFACTURER_PART_NUMBER: PMEG3030EP,115; MOUSER_PART_NUMBER: 771-PMEG3030EP115; MOUSER_PRICE-STOCK: https://www.mouser.com/Search/Refine.aspx?Keyword=771-PMEG3030EP115; RS_PART_NUMBER: 7805391P; RS_PRICE-STOCK: http://uk.rs-online.com/web/p/products/7805391P
D7 D8 = samacsys:SMAJ24CA-Q: Bourns SMAJ24CA-Q, Bi-Directional TVS Diode, 400W, 2-Pin DO-214AC Source: Datasheet <https://www.bourns.com/docs/Product-Datasheets/SMAJ-Q.pdf>; DESCRIPTION: Bourns SMAJ24CA-Q, Bi-Directional TVS Diode, 400W, 2-Pin DO-214AC; HEIGHT: 2.29mm; MANUFACTURER_NAME: Bourns; MANUFACTURER_PART_NUMBER: SMAJ24CA-Q; MOUSER_PART_NUMBER: 652-SMAJ24CA-Q; MOUSER_PRICE-STOCK: https://www.mouser.com/Search/Refine.aspx?Keyword=652-SMAJ24CA-Q; RS_PART_NUMBER: 1723235P; RS_PRICE-STOCK: http://uk.rs-online.com/web/p/products/1723235P
FL1 = samacsys:ACT45L-201-2P-TL000: Common mode choke SMD 200uH 100mA 50V TDK ACT Series Shielded SMD Common Mode Line Filter 200 uH -30 %, 50 % 100mA Idc Source: Datasheet <http://docs-emea.rs-online.com/webdocs/14e9/0900766b814e92b2.pdf>; DESCRIPTION: Common mode choke SMD 200uH 100mA 50V TDK ACT Series Shielded SMD Common Mode Line Filter 200 uH -30 %, 50 % 100mA Idc; HEIGHT: mm; MANUFACTURER_NAME: TDK; MANUFACTURER_PART_NUMBER: ACT45L-201-2P-TL000; MOUSER_PART_NUMBER: 810-ACT45L2012PTL000; MOUSER_PRICE-STOCK: https://www.mouser.com/Search/Refine.aspx?Keyword=810-ACT45L2012PTL000; RS_PART_NUMBER: 8319282P; RS_PRICE-STOCK: http://uk.rs-online.com/web/p/products/8319282P
FL2-FL4 = samacsys:BLM18PG330SN1D: BLM18_N1D Series EMI Suppression Filter 33+/-25% at 100MHz 3A @85 Source: Datasheet <https://www.murata.com/en-us/products/productdetail?partno=BLM18PG330SN1#>; DESCRIPTION: BLM18_N1D Series EMI Suppression Filter 33+/-25% at 100MHz 3A @85; HEIGHT: 0.95mm; MANUFACTURER_NAME: Murata Electronics; MANUFACTURER_PART_NUMBER: BLM18PG330SN1D; MOUSER_PART_NUMBER: 81-BLM18PG330SN1D; MOUSER_PRICE-STOCK: https://www.mouser.com/Search/Refine.aspx?Keyword=81-BLM18PG330SN1D; RS_PART_NUMBER: 7241416P; RS_PRICE-STOCK: http://uk.rs-online.com/web/p/products/7241416P
IC1 = samacsys:SST26VF032BT-104I_SM: Microchip Technology SST26VF032BT-104I/SM 32Mbit Flash Memory Chip, 8-Pin SOIJ Source: Datasheet <http://www.microchip.com/mymicrochip/filehandler.aspx?ddocname=en566514>; ALLIED_NUMBER: 70571081; ALLIED_PRICE-STOCK: https://www.alliedelec.com/microchiptechnologyinc-sst26vf032bt-104i-sm/70571081/; DESCRIPTION: Microchip Technology SST26VF032BT-104I/SM 32Mbit Flash Memory Chip, 8-Pin SOIJ; HEIGHT: 2.03mm; MANUFACTURER_NAME: Microchip; MANUFACTURER_PART_NUMBER: SST26VF032BT-104I/SM; MOUSER_PART_NUMBER: 579-T26VF032BT104ISM; MOUSER_PRICE-STOCK: https://www.mouser.com/Search/Refine.aspx?Keyword=579-T26VF032BT104ISM; RS_PART_NUMBER: 1779838P; RS_PRICE-STOCK: http://uk.rs-online.com/web/p/products/1779838P
IC2 = samacsys:ATSAMV71Q21B-AABT: ARM Microcontrollers - MCU 2MB FLASH 384KB SRAM LQFP144 T/R Source: Datasheet <https://www.mouser.com/datasheet/2/268/SAM-E70S70V70V71-Family_DataSheet-DS60001527B-1374834.pdf>; DESCRIPTION: ARM Microcontrollers - MCU 2MB FLASH 384KB SRAM LQFP144 T/R; HEIGHT: 1.6mm; MANUFACTURER_NAME: Microchip; MANUFACTURER_PART_NUMBER: ATSAMV71Q21B-AABT; MOUSER_PART_NUMBER: 579-ATSAMV71Q21BAABT; MOUSER_PRICE-STOCK: https://www.mouser.com/Search/Refine.aspx?Keyword=579-ATSAMV71Q21BAABT
IC3 = samacsys:TJA1100HNZ: NXP - TJA1100HNZ - ETHERNET PHY, AEC-Q100, 100MBPS, HVQFN36 Source: Datasheet <https://www.nxp.com/docs/en/data-sheet/TJA1100.pdf>; DESCRIPTION: NXP - TJA1100HNZ - ETHERNET PHY, AEC-Q100, 100MBPS, HVQFN36; HEIGHT: 1mm; MANUFACTURER_NAME: Nexperia; MANUFACTURER_PART_NUMBER: TJA1100HNZ; MOUSER_PART_NUMBER: 771-TJA1100HNZ; MOUSER_PRICE-STOCK: https://www.mouser.com/Search/Refine.aspx?Keyword=771-TJA1100HNZ
IC4 = samacsys:FT2232HL: Dual High Speed USB UART/FIFO IC, LQFP64 FTDI Chip FT2232HL Dual UART Interface RS232, RS422, RS485 480Mbit/s, 64-Pin, LQFP Source: Datasheet <http://docs-emea.rs-online.com/webdocs/1384/0900766b81384546.pdf>; DESCRIPTION: Dual High Speed USB UART/FIFO IC, LQFP64 FTDI Chip FT2232HL Dual UART Interface RS232, RS422, RS485 480Mbit/s, 64-Pin, LQFP; HEIGHT: 1.6mm; MANUFACTURER_NAME: FTDI Chip; MANUFACTURER_PART_NUMBER: FT2232HL; RS_PART_NUMBER: 6877720P; RS_PRICE-STOCK: http://uk.rs-online.com/web/p/products/6877720P
IC13 IC18 = samacsys:TLE9250XSJXUMA1: CAN Interface IC TRANSCEIVER Source: Datasheet <https://www.infineon.com/dgdl/Infineon-TLE9250X-DS-v01_00-EN.pdf?fileId=5546d4625debb399015e14b8cc665980>; DESCRIPTION: CAN Interface IC TRANSCEIVER; HEIGHT: 1.73mm; MANUFACTURER_NAME: Infineon; MANUFACTURER_PART_NUMBER: TLE9250XSJXUMA1; MOUSER_PART_NUMBER: 726-TLE9250XSJXUMA1; MOUSER_PRICE-STOCK: https://www.mouser.com/Search/Refine.aspx?Keyword=726-TLE9250XSJXUMA1
J1 J2 = 2305018-2:2305018-2: TYPE C Right Angle Sealable SMT IPX8 3.1 GEN 2 Wire to Board USB; MANUFACTURER: TE Connectivity; PARTREV: 6.0; STANDRAD: Manufacturer Recommendation
J3-J6 = samacsys:TBL009-254-04GY-2GY: Fixed Terminal Blocks Terminal block, screwless, 2.54, Horizontal, 4, Gray w Gray Button Source: Datasheet <https://componentsearchengine.com/Datasheets/1/TBL009-254-04GY-2GY.pdf>; DESCRIPTION: Fixed Terminal Blocks Terminal block, screwless, 2.54, Horizontal, 4, Gray w Gray Button; HEIGHT: 10mm; MANUFACTURER_NAME: CUI Devices; MANUFACTURER_PART_NUMBER: TBL009-254-04GY-2GY; MOUSER_PART_NUMBER: 490-TBL00925404GY2GY; MOUSER_PRICE-STOCK: https://www.mouser.com/Search/Refine.aspx?Keyword=490-TBL00925404GY2GY
L1 L2 = samacsys:0603CS-R12XGLU: COILCRAFT - 0603CS-R12XGLU - High Frequency Inductor, 120 nH, 0603CS Series, 300 mA, 0603 [1608 Metric], Wirewound, 0.65 ohm Source: Datasheet <https://www.coilcraft.com/pdfs/0603cs.pdf>; DESCRIPTION: COILCRAFT - 0603CS-R12XGLU - High Frequency Inductor, 120 nH, 0603CS Series, 300 mA, 0603 [1608 Metric], Wirewound, 0.65 ohm; HEIGHT: 1mm; MANUFACTURER_NAME: COILCRAFT; MANUFACTURER_PART_NUMBER: 0603CS-R12XGLU; MOUSER_PART_NUMBER: 994-0603CS-R12XGLU; MOUSER_PRICE-STOCK: https://www.mouser.com/Search/Refine.aspx?Keyword=994-0603CS-R12XGLU
L7 = samacsys:XAL4020-102MEC: Fixed Inductors 1uH 20% 9.6A 14.60mOhms AEC-Q200 Source: Datasheet <https://www.coilcraft.com/pdfs/xal4000.pdf>; DESCRIPTION: Fixed Inductors 1uH 20% 9.6A 14.60mOhms AEC-Q200; HEIGHT: mm; MANUFACTURER_NAME: COILCRAFT; MANUFACTURER_PART_NUMBER: XAL4020-102MEC; MOUSER_PART_NUMBER: 994-XAL4020-102MEC; MOUSER_PRICE-STOCK: https://www.mouser.com/Search/Refine.aspx?Keyword=994-XAL4020-102MEC
L8 = samacsys:XAL4040-103MEC: Fixed Inductors XAL4040 High Current 10 uH 20 % 3.1 A Source: Datasheet <http://www.mouser.com/ds/2/597/xal4000-270751.pdf>; DESCRIPTION: Fixed Inductors XAL4040 High Current 10 uH 20 % 3.1 A; HEIGHT: mm; MANUFACTURER_NAME: COILCRAFT; MANUFACTURER_PART_NUMBER: XAL4040-103MEC; MOUSER_PART_NUMBER: 994-XAL4040-103MEC; MOUSER_PRICE-STOCK: https://www.mouser.com/Search/Refine.aspx?Keyword=994-XAL4040-103MEC
L9 = samacsys:DO3316P-103MLB: Fixed Inductors DO3316P SMT Pwr Ind 10 uH 20 % 3.9 A Source: Datasheet <https://componentsearchengine.com/Datasheets/1/DO3316P-103MLB.pdf>; DESCRIPTION: Fixed Inductors DO3316P SMT Pwr Ind 10 uH 20 % 3.9 A; HEIGHT: 5.21mm; MANUFACTURER_NAME: COILCRAFT; MANUFACTURER_PART_NUMBER: DO3316P-103MLB; MOUSER_PART_NUMBER: 994-DO3316P-103MLB; MOUSER_PRICE-STOCK: https://www.mouser.com/Search/Refine.aspx?Keyword=994-DO3316P-103MLB
LED1 LED4-LED7 LED11-LED16 = led:LED: LED OSRAM: - CHIPLED LG R971, LG N971, LY N971, LG Q971, LY Q971, LO R971, LY R971 LH N974, LH R974 LS Q976, LO Q976, LY Q976 LO Q996 - Hyper CHIPLED LW Q18S LB Q993, LB Q99A, LB R99A - SideLED LS A670, LO A670, LY A670, LG A670, LP A670 LB A673, LV A673, LT A673, LW A673 LH A674 LY A675 LS A676, LA A676, LO A676, LY A676, LW A676 LS A679, LY A679, LG A679 - Hyper Micro SIDELED® LS Y876, LA Y876, LO Y876, LY Y876 LT Y87S - SmartLED LW L88C, LW L88S LB L89C, LB L89S, LG L890 LS L89K, LO L89K, LY L89K LS L896, LA L896, LO L896, LY L896 - TOPLED LS T670, LO T670, LY T670, LG T670, LP T670 LSG T670, LSP T670, LSY T670, LOP T670, LYG T670 LG T671, LOG T671, LSG T671 LB T673, LV T673, LT T673, LW T673 LH T674 LS T676, LA T676, LO T676, LY T676, LB T676, LH T676, LSB T676, LW T676 LB T67C, LV T67C, LT T67C, LS T67K, LO T67K, LY T67K, LW E67C LS E67B, LA E67B, LO E67B, LY E67B, LB E67C, LV E67C, LT E67C LW T67C LS T679, LY T679, LG T679 LS T770, LO T770, LY T770, LG T770, LP T770 LB T773, LV T773, LT T773, LW T773 LH T774 LS E675, LA E675, LY E675, LS T675 LS T776, LA T776, LO T776, LY T776, LB T776 LHGB T686 LT T68C, LB T68C - Hyper Mini TOPLED® LB M676 - Mini TOPLED Santana® LG M470 LS M47K, LO M47K, LY M47K Source: http://www.osram.convergy.de LUXEON: - LUMILED® LXK2-PW12-R00, LXK2-PW12-S00, LXK2-PW14-U00, LXK2-PW14-V00 LXK2-PM12-R00, LXK2-PM12-S00, LXK2-PM14-U00 LXK2-PE12-Q00, LXK2-PE12-R00, LXK2-PE12-S00, LXK2-PE14-T00, LXK2-PE14-U00 LXK2-PB12-K00, LXK2-PB12-L00, LXK2-PB12-M00, LXK2-PB14-N00, LXK2-PB14-P00, LXK2-PB14-Q00 LXK2-PR12-L00, LXK2-PR12-M00, LXK2-PR14-Q00, LXK2-PR14-R00 LXK2-PD12-Q00, LXK2-PD12-R00, LXK2-PD12-S00 LXK2-PH12-R00, LXK2-PH12-S00 LXK2-PL12-P00, LXK2-PL12-Q00, LXK2-PL12-R00 Source: www.luxeon.com KINGBRIGHT: KA-3528ASYC Source: www.kingbright.com
R1-R26 R31 R32 R82 R83 R85-R92 R95-R98 R103 R104 R183 R188 R193 R195-R197 = rcl:R-US_: RESISTOR, American symbol; SPICEPREFIX: R
TC1 = TagConnect:TC2050-IDC: Tag-Connect In Circuit Programming & Debug Cable 10 Pin http://www.tag-connect.com
U2 = LM63625:LM63625DQPWPRQ1; MANUFACTURER: Texas Instruments; PARTNUMBER: LM63625DQPWPTQ1; REFDES: RefDes; TYPE: TYPE; VALUE: Value
U3 = TPS62007:TPS62007-Q1_DGS_10; DATASHEET_URL: http://www.ti.com/lit/gpn/TPS62007-Q1; DESCRIPTION: Automotive Catalog High-Efficiency Step-Down Low Power DC-DC Converter; FAMILY_NAME: STEP-DOWN REGULATOR; GENERIC_PART_NUMBER: TPS62007-Q1; INDUSTRY_STD_PKG_TYPE: MSOP; MANUFACTURER: Texas Instruments; MANUFACTURER_PART_NUMBER: TPS62007-Q1_DGS_10; PACKAGE_DESIGNATOR: DGS; PIN_COUNT: 10; VENDOR: Texas Instruments
Y1 = samacsys:NX3225SA-25MHZ-EXS00A-CS11338: CRYSTAL 25MHZ 18PF SMD Source: Datasheet <https://media.digikey.com/pdf/Data Sheets/NDK PDFs/NX3225SA-25MHZ-EXS00A-CS11338.pdf>; DESCRIPTION: CRYSTAL 25MHZ 18PF SMD; HEIGHT: 0.6mm; MANUFACTURER_NAME: NDK; MANUFACTURER_PART_NUMBER: NX3225SA-25MHZ-EXS00A-CS11338
Y2 = samacsys:ABM8AIG-12.000MHZ-12-D2Z-T: ABRACON - ABM8AIG-12.000MHZ-12-D2Z-T - CRYSTAL, AECQ200, 12MHZ, 12PF, 3.2X2.5MM Source: Datasheet <https://www.mouser.com/datasheet/2/3/ABM8AIG-783590.pdf>; DESCRIPTION: ABRACON - ABM8AIG-12.000MHZ-12-D2Z-T - CRYSTAL, AECQ200, 12MHZ, 12PF, 3.2X2.5MM; HEIGHT: 0.8mm; MANUFACTURER_NAME: ABRACON; MANUFACTURER_PART_NUMBER: ABM8AIG-12.000MHz-12-D2Z-T; MOUSER_PART_NUMBER: 815-ABM8AIG1212D2ZT; MOUSER_PRICE-STOCK: https://www.mouser.com/Search/Refine.aspx?Keyword=815-ABM8AIG1212D2ZT
Y3 = samacsys:ABM8AIG-12.000MHZ-1Z-T: Crystals 18pF 12MHz 10ppm AEC-Q200 -40C +125C Source: Datasheet <https://abracon.com/AIGcrystals/ABM8AIG.pdf>; DESCRIPTION: Crystals 18pF 12MHz 10ppm AEC-Q200 -40C +125C; HEIGHT: 0mm; MANUFACTURER_NAME: ABRACON; MANUFACTURER_PART_NUMBER: ABM8AIG-12.000MHZ-1Z-T; MOUSER_PART_NUMBER: 815-M8AIG-12-1ZT; MOUSER_PRICE-STOCK: https://www.mouser.com/Search/Refine.aspx?Keyword=815-M8AIG-12-1ZT